# EAGLE design PLT Demo V2 R01 (EAGLE 9.6.2)
PCBITEM: T10-00438-XX; REVISION: R01

## Sheet 1 of 4: Power schematic
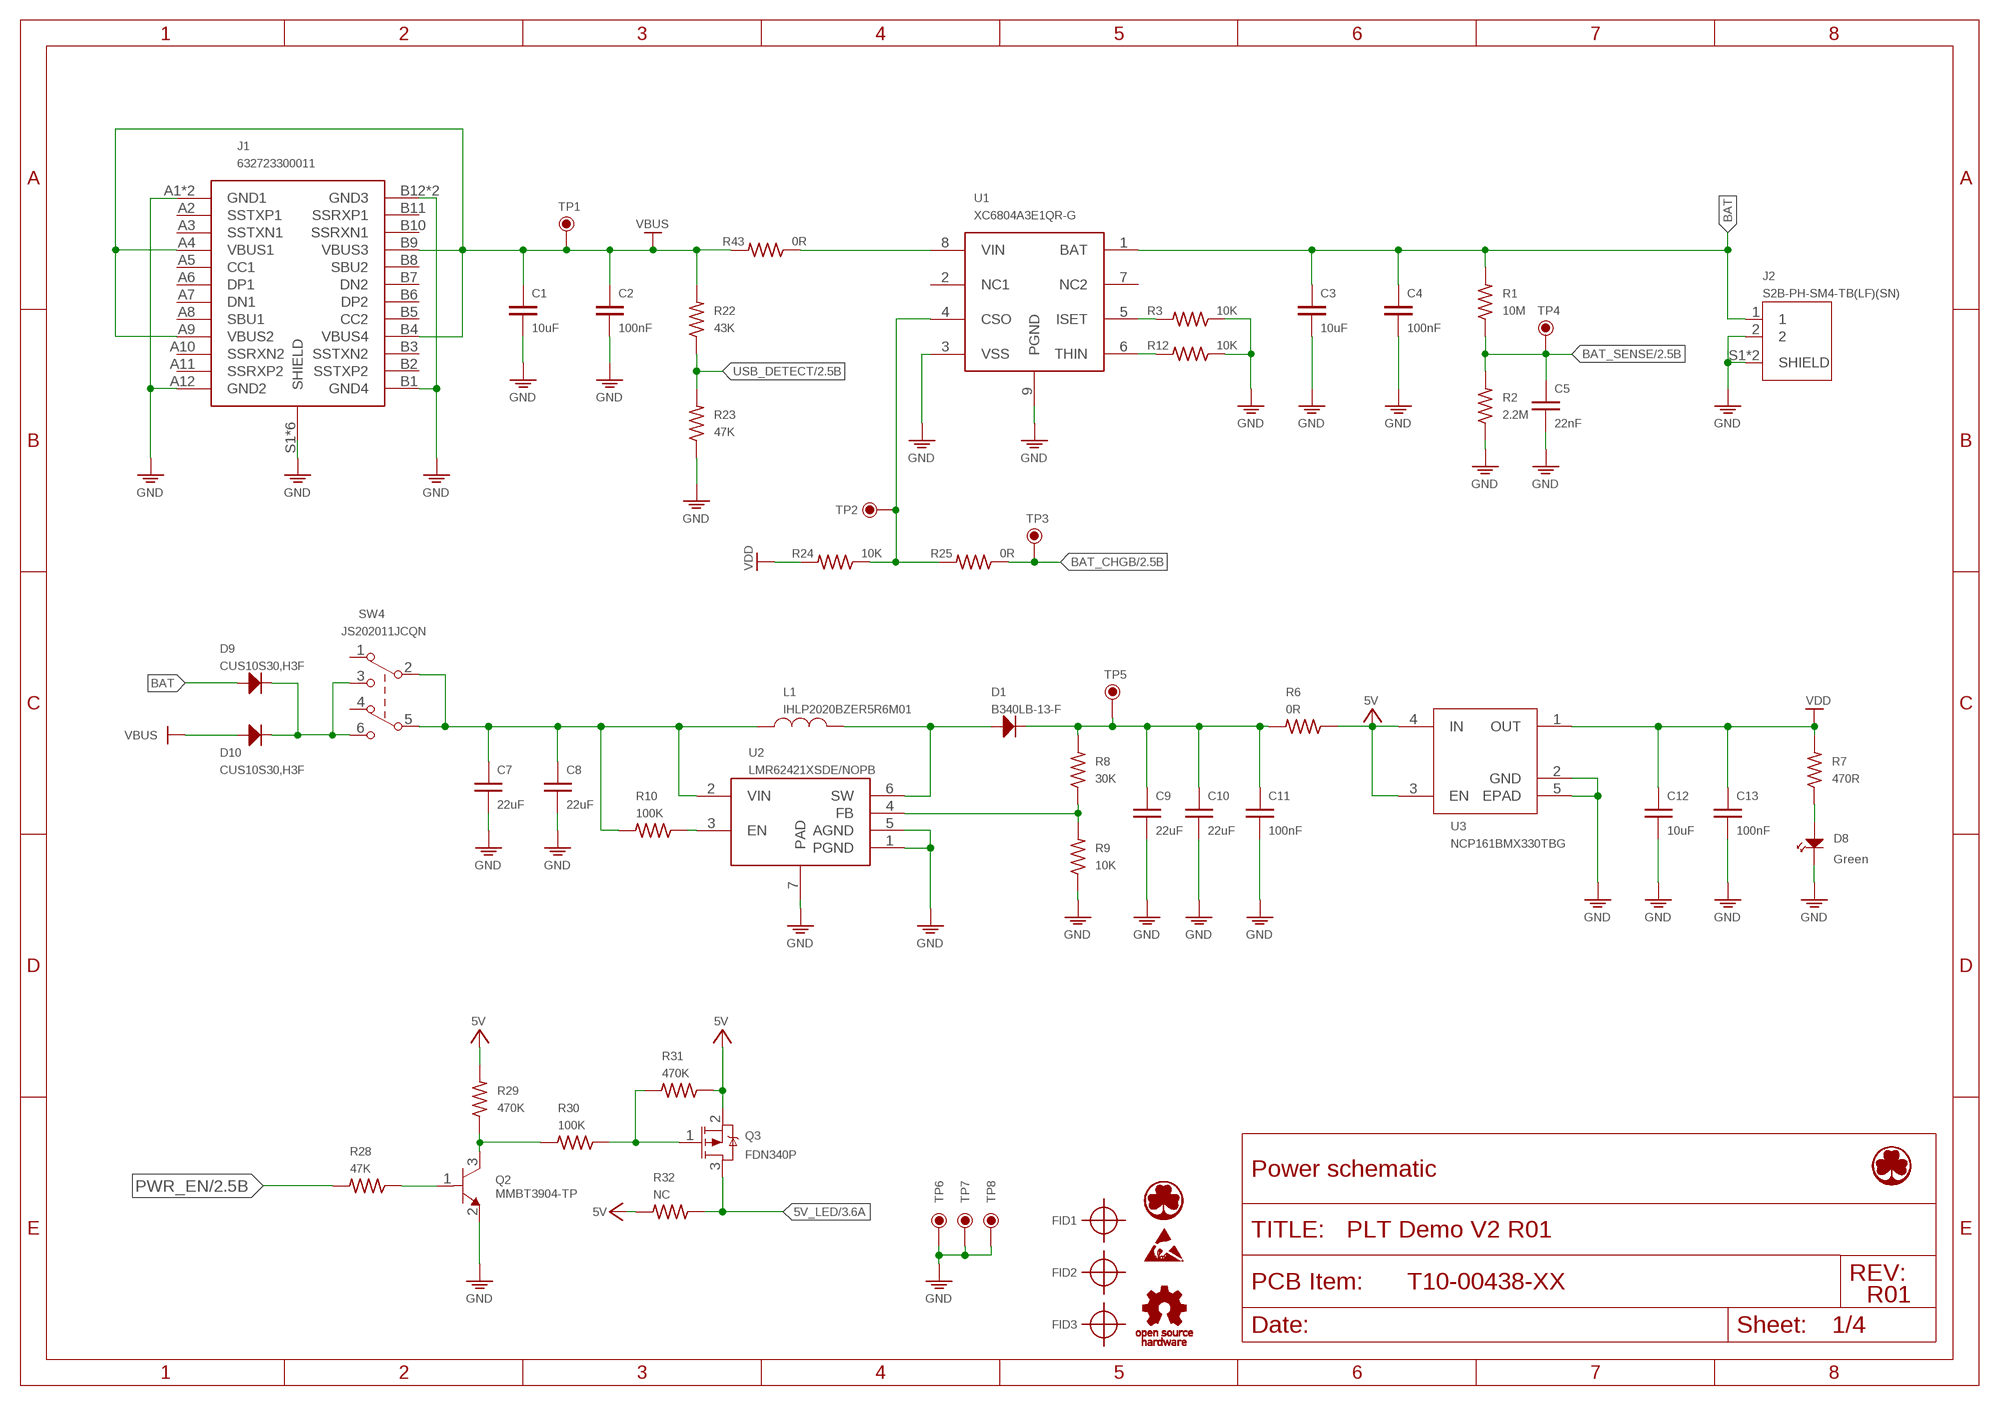
[diagram p0: schematic, sheet 1]

### Parts
C1  10uF  CAPC0603  [C0603]
C2  100nF  CAPC0603  [C0603]
C3  10uF  CAPC0603  [C0603]
C4  100nF  CAPC0603  [C0603]
C5  22nF  CAPC0603  [C0603]
C7  22uF  CAPC0603  [C0603]
C8  22uF  CAPC0603  [C0603]
C9  22uF  CAPC0603  [C0603]
C10  22uF  CAPC0603  [C0603]
C11  100nF  CAPC0603  [C0603]
C12  10uF  CAPC0603  [C0603]
C13  100nF  CAPC0603  [C0603]
D1  B340LB-13-F  [SMB]
D8  Green  LED-SMTLED0603  [LED0603]
D9  CUS10S30,H3F  [SOD-323]
D10  CUS10S30,H3F  [SOD-323]
FID1  SENSOR_MISC_FIDUCIAL-1MM  [SENSOR_MISC_FIDUCIAL-1MM]
FID2  SENSOR_MISC_FIDUCIAL-1MM  [SENSOR_MISC_FIDUCIAL-1MM]
FID3  SENSOR_MISC_FIDUCIAL-1MM  [SENSOR_MISC_FIDUCIAL-1MM]
J1  632723300011  632723X00011  [632723X00011]
J2  S2B-PH-SM4-TB(LF)(SN)  [S2B-PH-SM4-TB(LF)(SN)]
L1  IHLP2020BZER5R6M01  [IND-5220_SMD]
Q2  MMBT3904-TP  [SOT23]
Q3  FDN340P  [SOT23]
R1  10M  RESISTOR_USR0603  [R0603]
R2  2.2M  RESISTOR_USR0603  [R0603]
R3  10K  RESISTOR_USR0603  [R0603]
R6  0R  RESISTOR_USR0603  [R0603]
R7  470R  RESISTOR_USR0603  [R0603]
R8  30K  RESISTOR_USR0603  [R0603]
R9  10K  RESISTOR_USR0603  [R0603]
R10  100K  RESISTOR_USR0603  [R0603]
R12  10K  RESISTOR_USR0603  [R0603]
R22  43K  RESISTOR_USR0603  [R0603]
R23  47K  RESISTOR_USR0603  [R0603]
R24  10K  RESISTOR_USR0603  [R0603]
R25  0R  RESISTOR_USR0603  [R0603]
R28  47K  RESISTOR_USR0603  [R0603]
R29  470K  RESISTOR_USR0603  [R0603]
R30  100K  RESISTOR_USR0603  [R0603]
R31  470K  RESISTOR_USR0603  [R0603]
R32  NC  RESISTOR_USR0603  [R0603]
R43  0R  RESISTOR_USR0603  [R0603]
SW4  JS202011JCQN  [JS202011JCQN]
TP1  TPTP1.0X0.5_DIP  [TP1.0X0.5_DIP]
TP2  TPTP1.0X0.5_DIP  [TP1.0X0.5_DIP]
TP3  TPTP1.0X0.5_DIP  [TP1.0X0.5_DIP]
TP4  TPTP1.0X0.5_DIP  [TP1.0X0.5_DIP]
TP5  TPTP1.0X0.5_DIP  [TP1.0X0.5_DIP]
TP6  TPTP1.0X0.5_DIP  [TP1.0X0.5_DIP]
TP7  TPTP1.0X0.5_DIP  [TP1.0X0.5_DIP]
TP8  TPTP1.0X0.5_DIP  [TP1.0X0.5_DIP]
U1  XC6804A3E1QR-G  [SOP127P6X1.6-8NP]
U2  LMR62421XSDE/NOPB  [WSON095P3X3-6NPAD]
U3  NCP161BMX330TBG  [XDFN4]
U$4  BCD-LOGO  [BCD-LOGO]
U$5  ANTI-STATIC  [ANTI-STATIC]
U$6  OSHW-LOGO-R2000  [OSHW-LOGO-R2000]

### Nets
5V: Q3.2(S) R6.1 R29.2 R31.1 R32.2 U3.3(EN) U3.4(IN)
5V_LED: Q3.3(D) R32.1 ; also sheet 3
BAT: C3.1 C4.1 D9.1 J2.1 R1.2 U1.1(BAT)
BAT_CHGB: R25.1 TP3.1 ; also sheet 2
BAT_CHGB2: R24.1 R25.2 TP2.1 U1.4(CSO)
BAT_SENSE: C5.1 R1.1 R2.2 TP4.1 ; also sheet 2
GND: C1.2 C2.2 C3.2 C4.2 C5.2 C7.2 C8.2 C9.2 C10.2 C11.2 C12.2 C13.2 D8.2 J1.A1(GND1) J1.A12(GND2) J1.B1(GND4) J1.B12(GND3) J1.GND1(GND3) J1.GND(GND1) J1.S1(SHIELD) J1.S2(SHIELD) J1.S3(SHIELD) J1.S4(SHIELD) J1.S5(SHIELD) J1.S6(SHIELD) J2.2 J2.S1(SHIELD) J2.S2(SHIELD) Q2.2(E) R2.1 R3.1 R9.1 R12.1 R23.1 TP6.1 TP7.1 TP8.1 U1.3(VSS) U1.9(PGND) U2.1(PGND) U2.5(AGND) U2.7(PAD) U3.2(GND) U3.5(EPAD) ; also sheet 2,3,4
N$2: D1.1 L1.2 U2.6(SW)
N$3: C7.1 C8.1 L1.1 R10.2 SW4.2 SW4.5 U2.2(VIN)
N$4: R10.1 U2.3(EN)
N$5: R3.2 U1.5(ISET)
N$6: R43.1 U1.8(VIN)
N$7: R8.1 R9.2 U2.4(FB)
N$8: C9.1 C10.1 C11.1 D1.2 R6.2 R8.2 TP5.1
N$11: D8.1 R7.1
N$12: R12.2 U1.6(THIN)
N$13: Q2.3(C) R29.1 R30.2
N$14: Q2.1(B) R28.1
N$15: Q3.1(G) R30.1 R31.2
N$63: D9.2 D10.2 SW4.3 SW4.6
PWR_EN: R28.2 ; also sheet 2
USB_DETECT: R22.1 R23.2 ; also sheet 2
VBUS: C1.1 C2.1 D10.1 J1.A4(VBUS1) J1.A9(VBUS2) J1.B4(VBUS4) J1.B9(VBUS3) R22.2 R43.2 TP1.1
VDD: C12.1 C13.1 R7.2 R24.2 U3.1(OUT) ; also sheet 2,3,4
Unconnected: J1.A2(SSTXP1) J1.A3(SSTXN1) J1.A5(CC1) J1.A6(DP1) J1.A7(DN1) J1.A8(SBU1) J1.A10(SSRXN2) J1.A11(SSRXP2) J1.B2(SSTXP2) J1.B3(SSTXN2) J1.B5(CC2) J1.B6(DP2) J1.B7(DN2) J1.B8(SBU2) J1.B10(SSRXN1) J1.B11(SSRXP1) SW4.1 SW4.4 U1.2(NC1) U1.7(NC2)

## Sheet 2 of 4: Bluetooth schematic
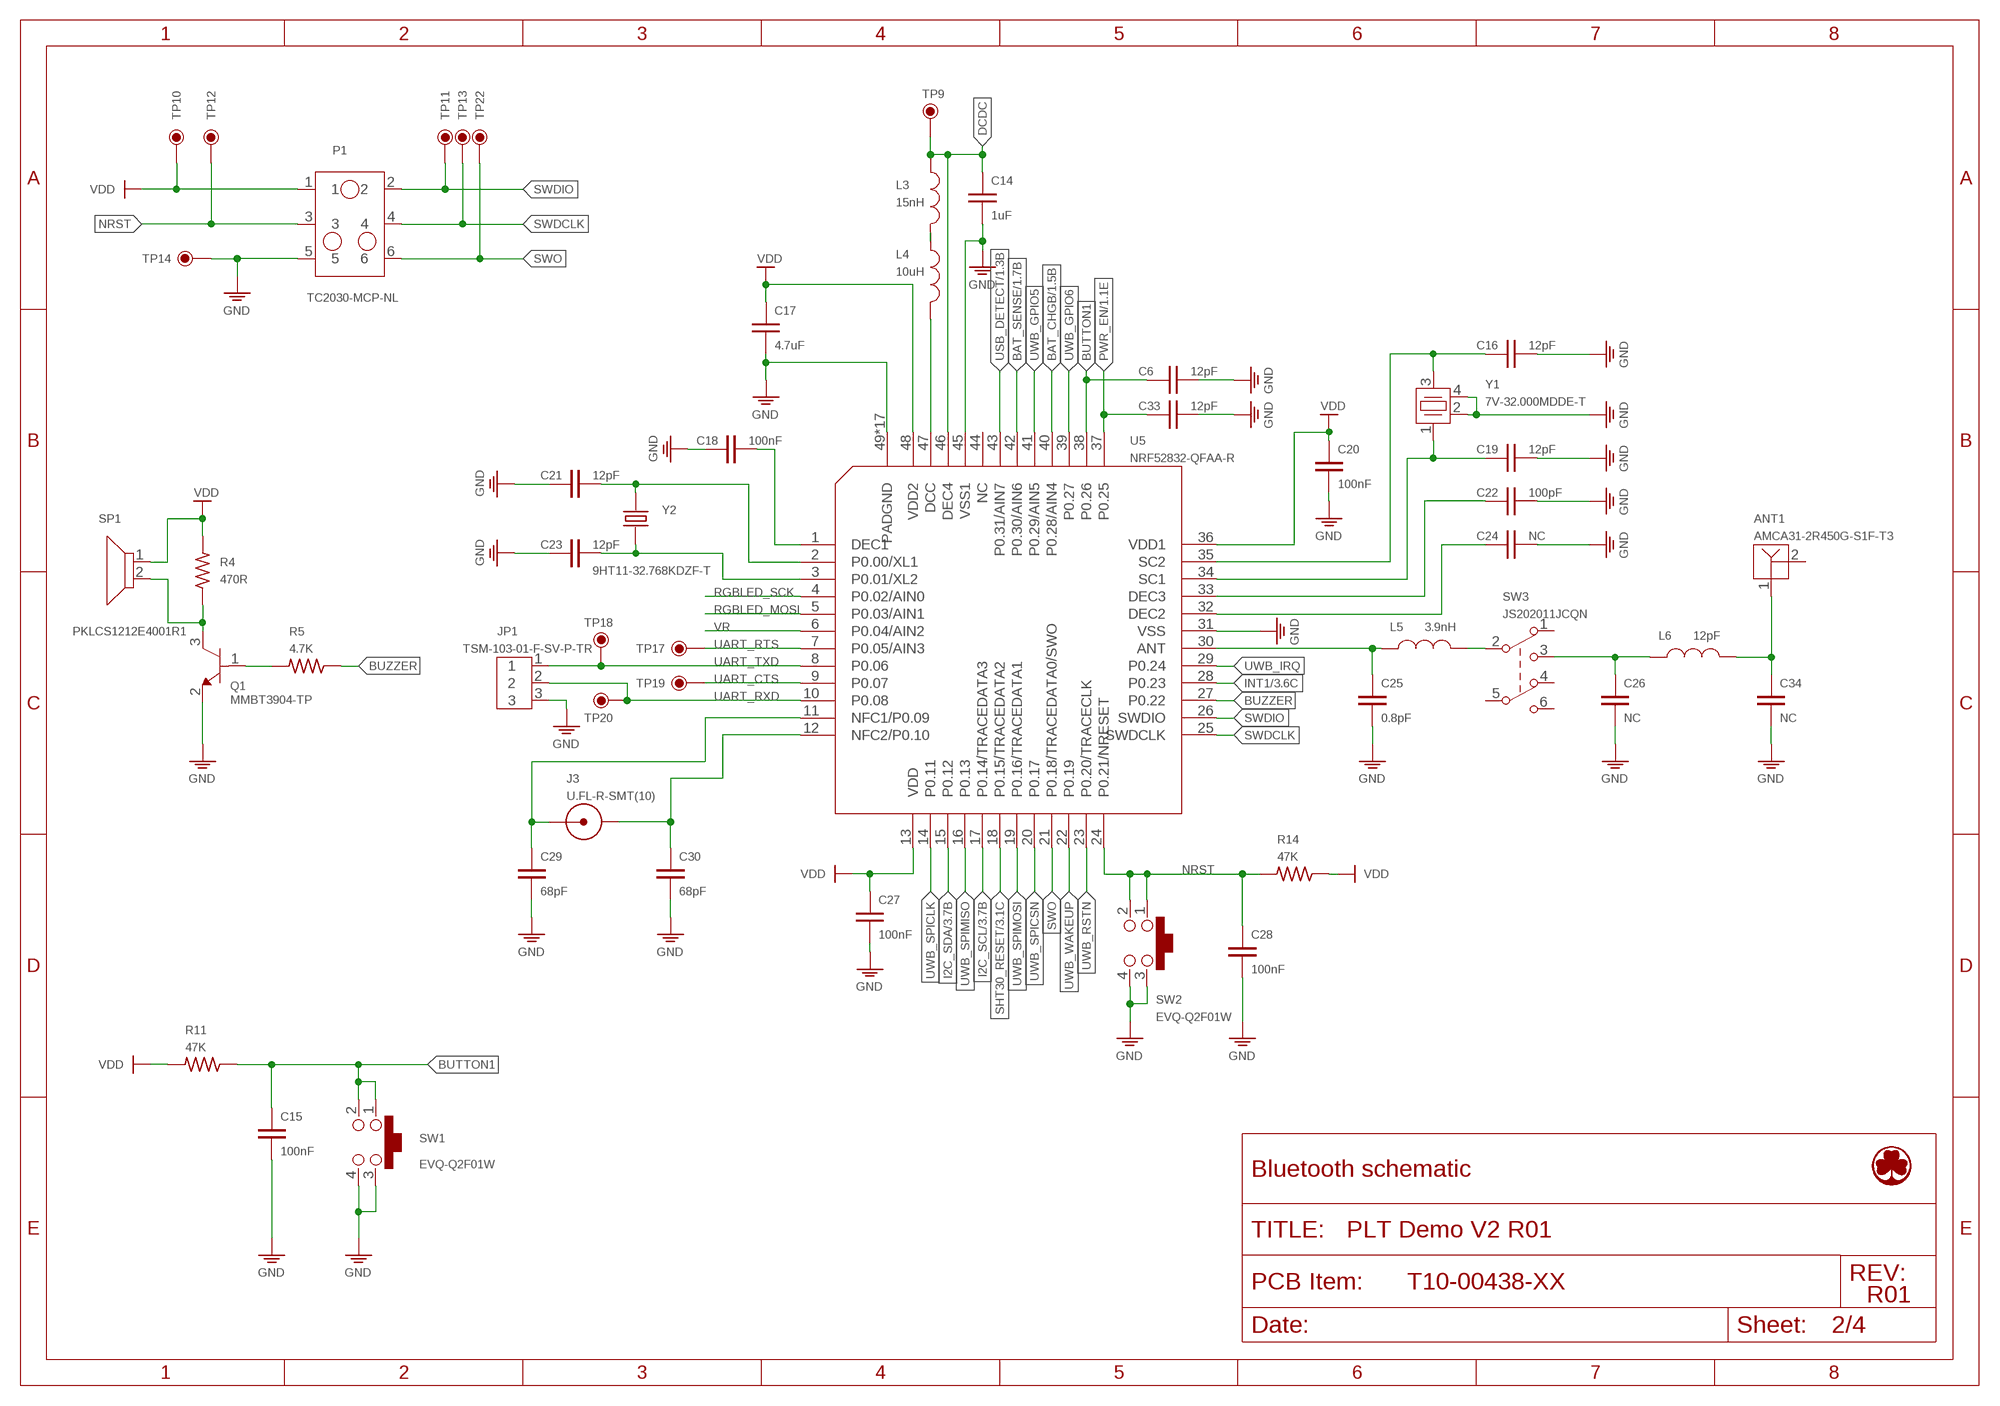
[diagram p1: schematic, sheet 2]

### Parts
ANT1  AMCA31-2R450G-S1F-T3  [ANT_3216]
C6  12pF  CAPC0603  [C0603]
C14  1uF  CAPC0603  [C0603]
C15  100nF  CAPC0603  [C0603]
C16  12pF  CAPC0603  [C0603]
C17  4.7uF  CAPC0603  [C0603]
C18  100nF  CAPC0603  [C0603]
C19  12pF  CAPC0603  [C0603]
C20  100nF  CAPC0603  [C0603]
C21  12pF  CAPC0603  [C0603]
C22  100pF  CAPC0603  [C0603]
C23  12pF  CAPC0603  [C0603]
C24  NC  CAPC0603  [C0603]
C25  0.8pF  CAPC0603  [C0603]
C26  NC  CAPC0603  [C0603]
C27  100nF  CAPC0603  [C0603]
C28  100nF  CAPC0603  [C0603]
C29  68pF  CAPC0603  [C0603]
C30  68pF  CAPC0603  [C0603]
C33  12pF  CAPC0603  [C0603]
C34  NC  CAPC0603  [C0603]
J3  U.FL-R-SMT(10)  [U.FL-R-SMT(10)]
JP1  TSM-103-01-F-SV-P-TR  [JMP254P1X3V-SMT]
L3  15nH  INDUCTOR-2N0603  [IND-0603]
L4  10uH  INDUCTOR-2N0603  [IND-0603]
L5  3.9nH  INDUCTOR-2N0603  [IND-0603]
L6  12pF  INDUCTOR-2N0603  [IND-0603]
P1  TC2030-MCP-NL  [TC2030-IDC]
Q1  MMBT3904-TP  [SOT23]
R4  470R  RESISTOR_USR0603  [R0603]
R5  4.7K  RESISTOR_USR0603  [R0603]
R11  47K  RESISTOR_USR0603  [R0603]
R14  47K  RESISTOR_USR0603  [R0603]
SP1  PKLCS1212E4001R1  [SPEAKER12X12_SMT]
SW1  EVQ-Q2F01W  SWITCH-4N-SMT  [SWITCH6.5X6_SMD]
SW2  EVQ-Q2F01W  SWITCH-4N-SMT  [SWITCH6.5X6_SMD]
SW3  JS202011JCQN  [JS202011JCQN]
TP9  TPTP1.0X0.5_DIP  [TP1.0X0.5_DIP]
TP10  TPTP1.0X0.5_DIP  [TP1.0X0.5_DIP]
TP11  TPTP1.0X0.5_DIP  [TP1.0X0.5_DIP]
TP12  TPTP1.0X0.5_DIP  [TP1.0X0.5_DIP]
TP13  TPTP1.0X0.5_DIP  [TP1.0X0.5_DIP]
TP14  TPTP1.0X0.5_DIP  [TP1.0X0.5_DIP]
TP17  TPTP1.0X0.5_DIP  [TP1.0X0.5_DIP]
TP18  TPTP1.0X0.5_DIP  [TP1.0X0.5_DIP]
TP19  TPTP1.0X0.5_DIP  [TP1.0X0.5_DIP]
TP20  TPTP1.0X0.5_DIP  [TP1.0X0.5_DIP]
TP22  TPTP1.0X0.5_DIP  [TP1.0X0.5_DIP]
U5  NRF52832-QFAA-R  NRF52832-QFAA-R-48NV  [QFN040P6X6-48NV]
Y1  7V-32.000MDDE-T  [OSC3.2X2.5-4N]
Y2  9HT11-32.768KDZF-T  [OSC2X1.2-2N]

### Nets
BAT_CHGB: U5.40(P0.28/AIN4) ; also sheet 1
BAT_SENSE: U5.42(P0.30/AIN6) ; also sheet 1
BUTTON1: C6.1 C15.1 R11.1 SW1.1 SW1.2 U5.38(P0.26)
BUZZER: R5.1 U5.27(P0.22)
DCDC: C14.1 L3.1 TP9.1 U5.46(DEC4)
GND: C6.2 C14.2 C15.2 C16.2 C17.2 C18.1 C19.2 C20.2 C21.1 C22.2 C23.1 C24.2 C25.2 C26.2 C27.2 C28.2 C29.2 C30.2 C33.2 C34.2 JP1.3 P1.5 Q1.2(E) SW1.3 SW1.4 SW2.3 SW2.4 TP14.1 U5.31(VSS) U5.45(VSS1) U5.49(PADGND) U5.P$1(PADGND) U5.P$2(PADGND) U5.P$3(PADGND) U5.P$4(PADGND) U5.P$5(PADGND) U5.P$6(PADGND) U5.P$7(PADGND) U5.P$8(PADGND) U5.P$9(PADGND) U5.P$10(PADGND) U5.P$11(PADGND) U5.P$12(PADGND) U5.P$13(PADGND) U5.P$14(PADGND) U5.P$15(PADGND) U5.P$16(PADGND) Y1.2 Y1.4 ; also sheet 1,3,4
I2C_SCL: U5.17(P0.14/TRACEDATA3) ; also sheet 3
I2C_SDA: U5.15(P0.12) ; also sheet 3
INT1: U5.28(P0.23) ; also sheet 3
N$9: C18.2 U5.1(DEC1)
N$10: C21.2 U5.2(P0.00/XL1) Y2.1
N$16: C23.2 U5.3(P0.01/XL2) Y2.2
N$17: C30.1 J3.2 J3.3 U5.12(NFC2/P0.10)
N$18: C29.1 J3.1 U5.11(NFC1/P0.09)
N$20: C25.1 L5.1 U5.30(ANT)
N$21: L3.2 L4.1
N$22: L4.2 U5.47(DCC)
N$33: C16.1 U5.35(SC2) Y1.3
N$34: Q1.3(C) R4.1 SP1.2
N$35: Q1.1(B) R5.2
N$36: C19.1 U5.34(SC1) Y1.1
N$37: C22.1 U5.33(DEC3)
N$38: C24.1 U5.32(DEC2)
N$39: L5.2 SW3.2
N$40: C26.1 L6.1 SW3.3
N$41: ANT1.1 C34.1 L6.2
NRST: C28.1 P1.3 R14.2 SW2.1 SW2.2 TP12.1 U5.24(P0.21/NRESET)
PWR_EN: C33.1 U5.37(P0.25) ; also sheet 1
RGBLED_MOSI: U5.5(P0.03/AIN1) ; also sheet 3
RGBLED_SCK: U5.4(P0.02/AIN0) ; also sheet 3
SHT30_RESET: U5.18(P0.15/TRACEDATA2) ; also sheet 3
SWDCLK: P1.4 TP13.1 U5.25(SWDCLK)
SWDIO: P1.2 TP11.1 U5.26(SWDIO)
SWO: P1.6 TP22.1 U5.21(P0.18/TRACEDATA0/SWO)
UART_CTS: TP19.1 U5.9(P0.07)
UART_RTS: TP17.1 U5.7(P0.05/AIN3)
UART_RXD: JP1.2 TP20.1 U5.10(P0.08)
UART_TXD: JP1.1 TP18.1 U5.8(P0.06)
USB_DETECT: U5.43(P0.31/AIN7) ; also sheet 1
UWB_GPIO5: U5.41(P0.29/AIN5)
UWB_GPIO6: U5.39(P0.27)
UWB_IRQ: U5.29(P0.24)
UWB_RSTN: U5.23(P0.20/TRACECLK)
UWB_SPICLK: U5.14(P0.11)
UWB_SPICSN: U5.20(P0.17)
UWB_SPIMISO: U5.16(P0.13)
UWB_SPIMOSI: U5.19(P0.16/TRACEDATA1)
UWB_WAKEUP: U5.22(P0.19)
VDD: C17.1 C20.1 C27.1 P1.1 R4.2 R11.2 R14.1 SP1.1 TP10.1 U5.13(VDD) U5.36(VDD1) U5.48(VDD2) ; also sheet 1,3,4
VR: U5.6(P0.04/AIN2) ; also sheet 3
Unconnected: ANT1.2 SW3.1 SW3.4 SW3.5 SW3.6 U5.44(NC)

## Sheet 3 of 4: LED schematic
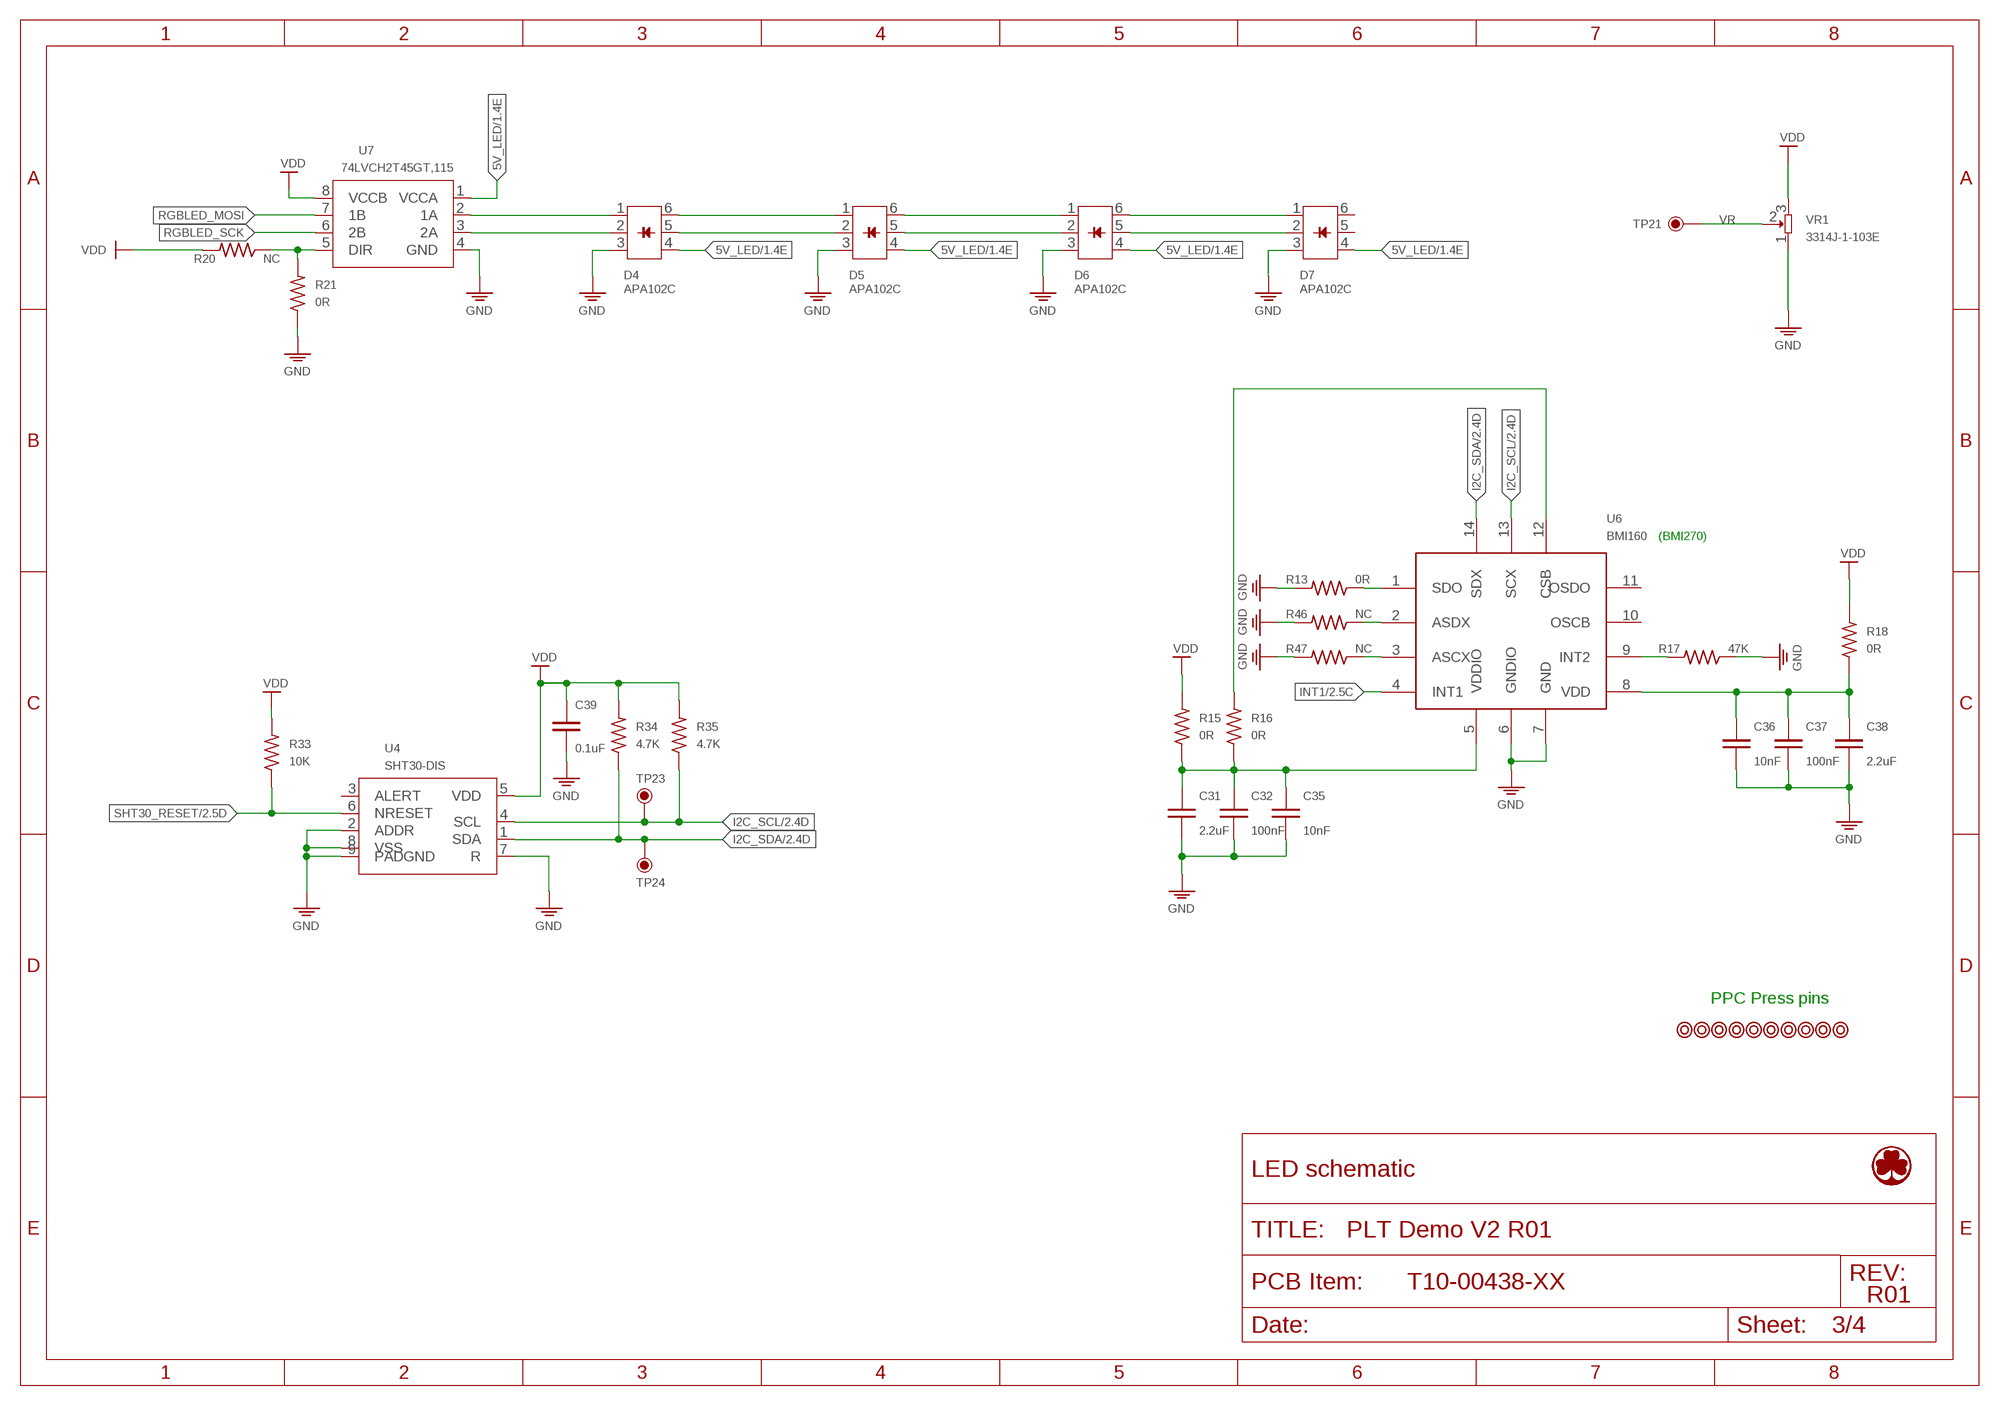
[diagram p2: schematic, sheet 3]

### Parts
C31  2.2uF  CAPC0603  [C0603]
C32  100nF  CAPC0603  [C0603]
C35  10nF  CAPC0603  [C0603]
C36  10nF  CAPC0603  [C0603]
C37  100nF  CAPC0603  [C0603]
C38  2.2uF  CAPC0603  [C0603]
C39  0.1uF  CAPC0603  [C0603]
D4  APA102C  [LED5X5-6N]
D5  APA102C  [LED5X5-6N]
D6  APA102C  [LED5X5-6N]
D7  APA102C  [LED5X5-6N]
PIN1  PRESS-PINS  [PRESS-PINS]
PIN2  PRESS-PINS  [PRESS-PINS]
PIN3  PRESS-PINS  [PRESS-PINS]
PIN4  PRESS-PINS  [PRESS-PINS]
PIN5  PRESS-PINS  [PRESS-PINS]
PIN6  PRESS-PINS  [PRESS-PINS]
PIN7  PRESS-PINS  [PRESS-PINS]
PIN8  PRESS-PINS  [PRESS-PINS]
PIN9  PRESS-PINS  [PRESS-PINS]
PIN10  PRESS-PINS  [PRESS-PINS]
R13  0R  RESISTOR_USR0603  [R0603]
R15  0R  RESISTOR_USR0603  [R0603]
R16  0R  RESISTOR_USR0603  [R0603]
R17  47K  RESISTOR_USR0603  [R0603]
R18  0R  RESISTOR_USR0603  [R0603]
R20  NC  RESISTOR_USR0603  [R0603]
R21  0R  RESISTOR_USR0603  [R0603]
R33  10K  RESISTOR_USR0603  [R0603]
R34  4.7K  RESISTOR_USR0603  [R0603]
R35  4.7K  RESISTOR_USR0603  [R0603]
R46  NC  RESISTOR_USR0603  [R0603]
R47  NC  RESISTOR_USR0603  [R0603]
TP21  TPTP1.0X0.5_DIP  [TP1.0X0.5_DIP]
TP23  TPTP1.0X0.5_DIP  [TP1.0X0.5_DIP]
TP24  TPTP1.0X0.5_DIP  [TP1.0X0.5_DIP]
U4  SHT30-DIS  SHT30-DISDFN050P2.5X2.5-8N  [DFN050P2.5X2.5-8N]
U6  BMI160  [LGA050P3X2.5-14N]
U7  74LVCH2T45GT,115  [XSON8-SOT833-1]
VR1  3314J-1-103E  [3314J-1-103E]

### Nets
5V_LED: D4.4 D5.4 D6.4 D7.4 U7.1(VCCA) ; also sheet 1
GND: C31.2 C32.2 C35.2 C36.2 C37.2 C38.2 C39.1 D4.3 D5.3 D6.3 D7.3 R13.2 R17.1 R21.1 R46.2 R47.2 U4.2(ADDR) U4.7(R) U4.8(VSS) U4.9(PADGND) U6.6(GNDIO) U6.7(GND) U7.4(GND) VR1.1 ; also sheet 1,2,4
I2C_SCL: R35.1 TP23.1 U4.4(SCL) U6.13(SCX) ; also sheet 2
I2C_SDA: R34.1 TP24.1 U4.1(SDA) U6.14(SDX) ; also sheet 2
INT1: U6.4(INT1) ; also sheet 2
N$1: R47.1 U6.3(ASCX)
N$19: R13.1 U6.1(SDO)
N$23: D4.1 U7.2(1A)
N$24: D4.2 U7.3(2A)
N$25: D4.6 D5.1
N$26: D4.5 D5.2
N$27: D5.6 D6.1
N$28: D5.5 D6.2
N$29: D6.6 D7.1
N$30: D6.5 D7.2
N$31: R17.2 U6.9(INT2)
N$32: R20.1 R21.2 U7.5(DIR)
N$42: C31.1 C32.1 C35.1 R15.1 R16.1 U6.5(VDDIO)
N$43: R16.2 U6.12(CSB)
N$44: C36.1 C37.1 C38.1 R18.1 U6.8(VDD)
N$62: R46.1 U6.2(ASDX)
RGBLED_MOSI: U7.7(1B) ; also sheet 2
RGBLED_SCK: U7.6(2B) ; also sheet 2
SHT30_RESET: R33.1 U4.6(NRESET) ; also sheet 2
VDD: C39.2 R15.2 R18.2 R20.2 R33.2 R34.2 R35.2 U4.5(VDD) U7.8(VCCB) VR1.3 ; also sheet 1,2,4
VR: TP21.1 VR1.2 ; also sheet 2
Unconnected: D7.5 D7.6 U4.3(ALERT) U6.10(OSCB) U6.11(OSDO)

### Notes on the sheet
- (BMI270)
- PPC Press pins

## Sheet 4 of 4: Test
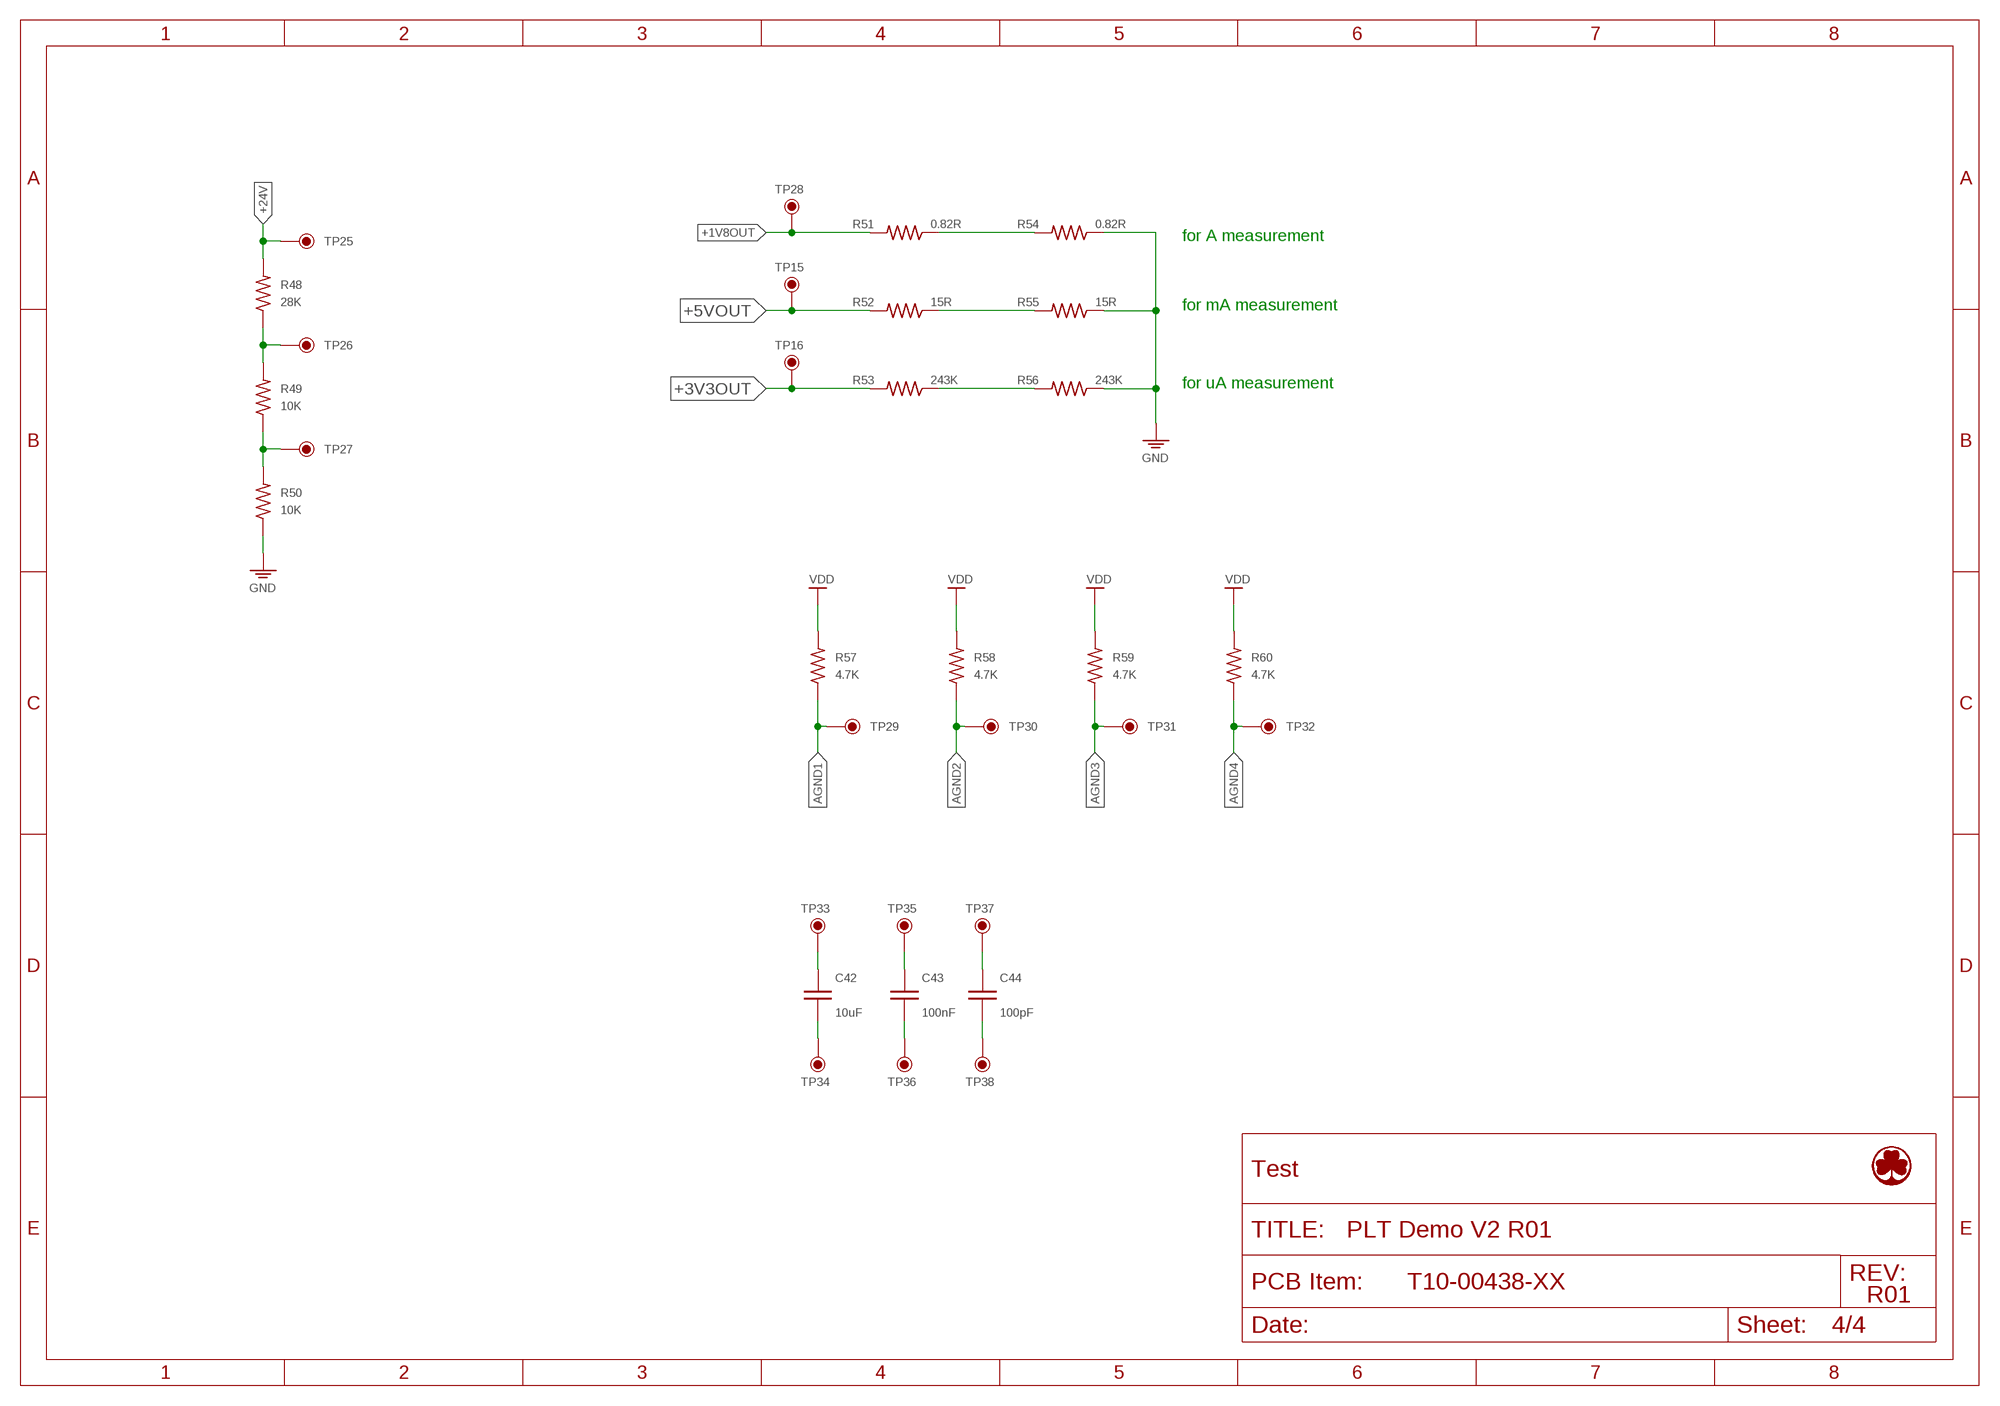
[diagram p3: schematic, sheet 4]

### Parts
C42  10uF  CAPC0805  [C0805]
C43  100nF  CAPC0603  [C0603]
C44  100pF  CAPC0603  [C0603]
R48  28K  RESISTOR_USR0603  [R0603]
R49  10K  RESISTOR_USR0603  [R0603]
R50  10K  RESISTOR_USR0603  [R0603]
R51  0.82R  RESISTOR_USR1210  [R1210]
R52  15R  RESISTOR_USR0805  [R0805]
R53  243K  RESISTOR_USR0603  [R0603]
R54  0.82R  RESISTOR_USR1210  [R1210]
R55  15R  RESISTOR_USR0805  [R0805]
R56  243K  RESISTOR_USR0603  [R0603]
R57  4.7K  RESISTOR_USR0603  [R0603]
R58  4.7K  RESISTOR_USR0603  [R0603]
R59  4.7K  RESISTOR_USR0603  [R0603]
R60  4.7K  RESISTOR_USR0603  [R0603]
TP15  TPTP1.0X0.5_DIP  [TP1.0X0.5_DIP]
TP16  TPTP1.0X0.5_DIP  [TP1.0X0.5_DIP]
TP25  TPTP1.0X0.5_DIP  [TP1.0X0.5_DIP]
TP26  TPTP1.0X0.5_DIP  [TP1.0X0.5_DIP]
TP27  TPTP1.0X0.5_DIP  [TP1.0X0.5_DIP]
TP28  TPTP1.0X0.5_DIP  [TP1.0X0.5_DIP]
TP29  TPTP1.0X0.5_DIP  [TP1.0X0.5_DIP]
TP30  TPTP1.0X0.5_DIP  [TP1.0X0.5_DIP]
TP31  TPTP1.0X0.5_DIP  [TP1.0X0.5_DIP]
TP32  TPTP1.0X0.5_DIP  [TP1.0X0.5_DIP]
TP33  TPTP1.0X0.5_DIP  [TP1.0X0.5_DIP]
TP34  TPTP1.0X0.5_DIP  [TP1.0X0.5_DIP]
TP35  TPTP1.0X0.5_DIP  [TP1.0X0.5_DIP]
TP36  TPTP1.0X0.5_DIP  [TP1.0X0.5_DIP]
TP37  TPTP1.0X0.5_DIP  [TP1.0X0.5_DIP]
TP38  TPTP1.0X0.5_DIP  [TP1.0X0.5_DIP]

### Nets
+1V8OUT: R51.2 TP28.1
+3V3OUT: R53.2 TP16.1
+5VOUT: R52.2 TP15.1
+24V: R48.2 TP25.1
AGND1: R57.1 TP29.1
AGND2: R58.1 TP30.1
AGND3: R59.1 TP31.1
AGND4: R60.1 TP32.1
GND: R50.1 R54.1 R55.1 R56.1 ; also sheet 1,2,3
N$45: R51.1 R54.2
N$46: R52.1 R55.2
N$47: R53.1 R56.2
N$64: R49.1 R50.2 TP27.1
N$65: R48.1 R49.2 TP26.1
N$72: C42.2 TP34.1
N$73: C42.1 TP33.1
N$74: C43.2 TP36.1
N$75: C43.1 TP35.1
N$76: C44.2 TP38.1
N$77: C44.1 TP37.1
VDD: R57.2 R58.2 R59.2 R60.2 ; also sheet 1,2,3

### Notes on the sheet
- for A measurement
- for mA measurement
- for uA measurement

## Library data of the parts
ANT1 = Eagle Part Library:AMCA31-2R450G-S1F-T3: RF ANT 2.4GHZ CHIP SOLDER SMD Source: Datasheet <https://abracon.com/chip-antenna/AMCA31-2R450G-S1F-T3.pdf>; MANUFACTURER_PART_NUMBER: AMCA31-2R450G-S1F-T3; VENDOR: Abracon LLC
C1-C39 C42-C44 = Eagle Part Library:CAP
D1 = Eagle Part Library:B340LB-13-F: DIODE SCHOTTKY 40V 3A SMB Source: Datasheet <https://www.diodes.com/assets/Datasheets/ds30240.pdf>; MANUFACTURER_PART_NUMBER: B340LB-13-F; VENDOR: Diodes Incorporated
D4-D7 = Eagle Part Library:APA102C
D8 = Eagle Part Library:LED-SMT
D9 D10 = Eagle Part Library:CUS10S30,H3F: DIODE SCHOTTKY 30V 1A USC Source: Datasheet <https://toshiba.semicon-storage.com/info/docget.jsp?did=14077&prodName=CUS10S30>; MANUFACTURER_PART_NUMBER: CUS10S30,H3F; VENDOR: Toshiba Semiconductor and Storage
FID1-FID3 = Eagle Part Library:SENSOR_MISC_FIDUCIAL: Fiducial marker on PCB. This has a matching schematic symbol so that it can show up in a centroid file.
J1 = Eagle Part Library:632723X00011: USB-C (USB TYPE-C) USB 3.2 Gen 2 (USB 3.1 Gen 2, Superspeed + (USB 3.1)) Receptacle Connector 24 Position Surface Mount, Right Angle; Through Hole Source: Datasheet <https://katalog.we-online.de/em/datasheet/632723x00011.pdf>; MANUFACTURER_PART_NUMBER: 632723300011; VENDOR: Wurth Electronics
J2 = Eagle Part Library:S2B-PH-SM4-TB(LF)(SN): CONN HEADER SMD R/A 2POS 2MM Source: Datasheet <https://www.jst-mfg.com/product/pdf/eng/ePH.pdf>; MANUFACTURER_PART_NUMBER: S2B-PH-SM4-TB(LF)(SN); VENDOR: JST Sales America Inc
J3 = Eagle Part Library:U.FL-R-SMT(10): CONN U.FL RCPT STR 50 OHM SMD Source: Datasheet <https://media.digikey.com/pdf/Data%20Sheets/Hirose%20PDFs/UFL%20Series.pdf>; MANUFACTURER_PART_NUMBER: U.FL-R-SMT(10); VENDOR: Hirose Electric Co Ltd
JP1 = Eagle Part Library:TSM-103-01-F-SV-P-TR: CONN HEADER SMD 3POS 2.54MM Source: Datasheet <https://www.digikey.hk/en/product-highlight/s/samtec/flexible-stacking-solutions>; MANUFACTURER_PART_NUMBER: TSM-103-01-F-SV-P-TR; VENDOR: Samtec Inc
L1 = Eagle Part Library:IHLP2020BZER5R6M01: FIXED IND 5.6UH 2.5A 122 MOHM Source: Datasheet <https://www.vishay.com/docs/34253/ihlp-2020bz-01.pdf>; MANUFACTURER_PART_NUMBER: IHLP2020BZER5R6M01; VENDOR: Vishay Dale
L3-L6 = Eagle Part Library:INDUCTOR-2N
P1 = Eagle Part Library:TC2030-MCP-NL: CABLE TAG-CONNECT IN-CIRCUIT Source: Datasheet <https://www.tag-connect.com/wp-content/uploads/bsk-pdf-manager/TC2030-MCP-NL_PCB_Footprint_5.pdf>; MANUFACTURER_PART_NUMBER: TC2030-MCP-NL-10-ND; VENDOR: Tag-Connect LLC
PIN1-PIN10 = Eagle Part Library:PRESS-PINS: press pins
Q1 Q2 = Eagle Part Library:MMBT3904-TP: TRANSISTOR NPN 40V 200MA SOT-23
Q3 = Eagle Part Library:FDN340P: MOSFET P-CH 20V 2A SOT3 Source: Datasheet <https://www.onsemi.com/pub/Collateral/FDN340P-D.PDF>; MANUFACTURER_PART_NUMBER: FDN340P; VENDOR: ON Semiconductor
R1-R18 R20-R25 R28-R35 R43 R46-R60 = Eagle Part Library:RESISTOR_US: RESISTOR, American symbol
SP1 = Eagle Part Library:PKLCS1212E4001R1: BUZZER SMD CONTINUOUS 75DB 4KHZ
SW1 SW2 = Eagle Part Library:SWITCH-4N-SMT
SW3 SW4 = Eagle Part Library:JS202011JCQN: SWITCH SLIDE DPDT 300MA 6V Source: Datasheet <https://www.ckswitches.com/media/1422/js.pdf>; MANUFACTURER_PART_NUMBER: JS202011JCQN; VENDOR: C&K
TP1-TP38 = Eagle Part Library:TP: Teset
U1 = Eagle Part Library:XC6804A3E1QR-G: IC BATT CHG LI-ION 1CELL 8SOPFD Source: Datasheet <https://www.torexsemi.com/file/xc6804/XC6804.pdf>; MANUFACTURER_PART_NUMBER: XC6804A3E1QR-G; VENDOR: Torex Semiconductor Ltd
U2 = Eagle Part Library:LMR62421XSDE/NOPB: IC REG BST SEPIC ADJ 2.1A 6WSON Source: Datasheet <https://www.ti.com/lit/ds/symlink/lmr62421.pdf?HQS=dis-dk-null-digikeymode-dsf-pf-null-wwe&ts=1620874435898&ref_url=https%253A%252F%252Fwww.digikey.hk%252F>; MANUFACTURER_PART_NUMBER: LMR62421XSDE/NOPB; VENDOR: Texas Instruments
U3 = Eagle Part Library:NCP161BMX330TBG: IC REG LINEAR 3.3V 450MA 4XDFN
U4 = Eagle Part Library:SHT30-DIS: Digital Humidity & Temperature Sensor
U5 = Eagle Part Library:NRF52832-QFAA-R: IC RF TXRX+MCU BLUETOOTH 48QFN Source: Datasheet <http://infocenter.nordicsemi.com/pdf/nRF52832_PS_v1.4.pdf>; MANUFACTURER_PART_NUMBER: NRF52832-QFAA-R; VENDOR: Nordic Semiconductor ASA
U6 = Eagle Part Library:BMI160: IMU ACCEL/GYRO I2C/SPI 14LGA Source: Datasheet <https://www.bosch-sensortec.com/media/boschsensortec/downloads/datasheets/bst-bmi160-ds000.pdf>; MANUFACTURER_PART_NUMBER: BMI160; VENDOR: Bosch Sensortec
U7 = Eagle Part Library:74LVCH2T45GT,115: IC TRNSLTR BIDIRECTIONAL 8XSON
U$4 = Eagle Part Library:BCD-LOGO: BCD LOGO
U$5 = Eagle Part Library:ANTI-STATIC: Anti-static
U$6 = Eagle Part Library:OSHW-LOGO-R2000: OSHW-Logo-R2000
VR1 = Eagle Part Library:3314J-1-103E: TRIMMER 10K OHM 0.25W J LEAD TOP Source: Datasheet <https://www.bourns.com/docs/Product-Datasheets/3314.pdf>; MANUFACTURER_PART_NUMBER: 3314J-1-103E; VENDOR: Bourns Inc
Y1 = Eagle Part Library:7V-32.000MDDE-T: CRYSTAL 32.0000MHZ 12PF SMD Source: Datasheet <http://www.txccrystal.com/images/pdf/7v.pdf>; MANUFACTURER_PART_NUMBER: 7V-32.000MDDE-T; VENDOR: TXC CORPORATION
Y2 = Eagle Part Library:9HT11-32.768KDZF-T: CRYSTAL 32.7680KHZ 12.5PF SMD Source: Datasheet <http://www.txccrystal.com/images/pdf/9ht11.pdf>; MANUFACTURER_PART_NUMBER: 9HT11-32.768KDZF-T; VENDOR: TXC CORPORATION

## Board
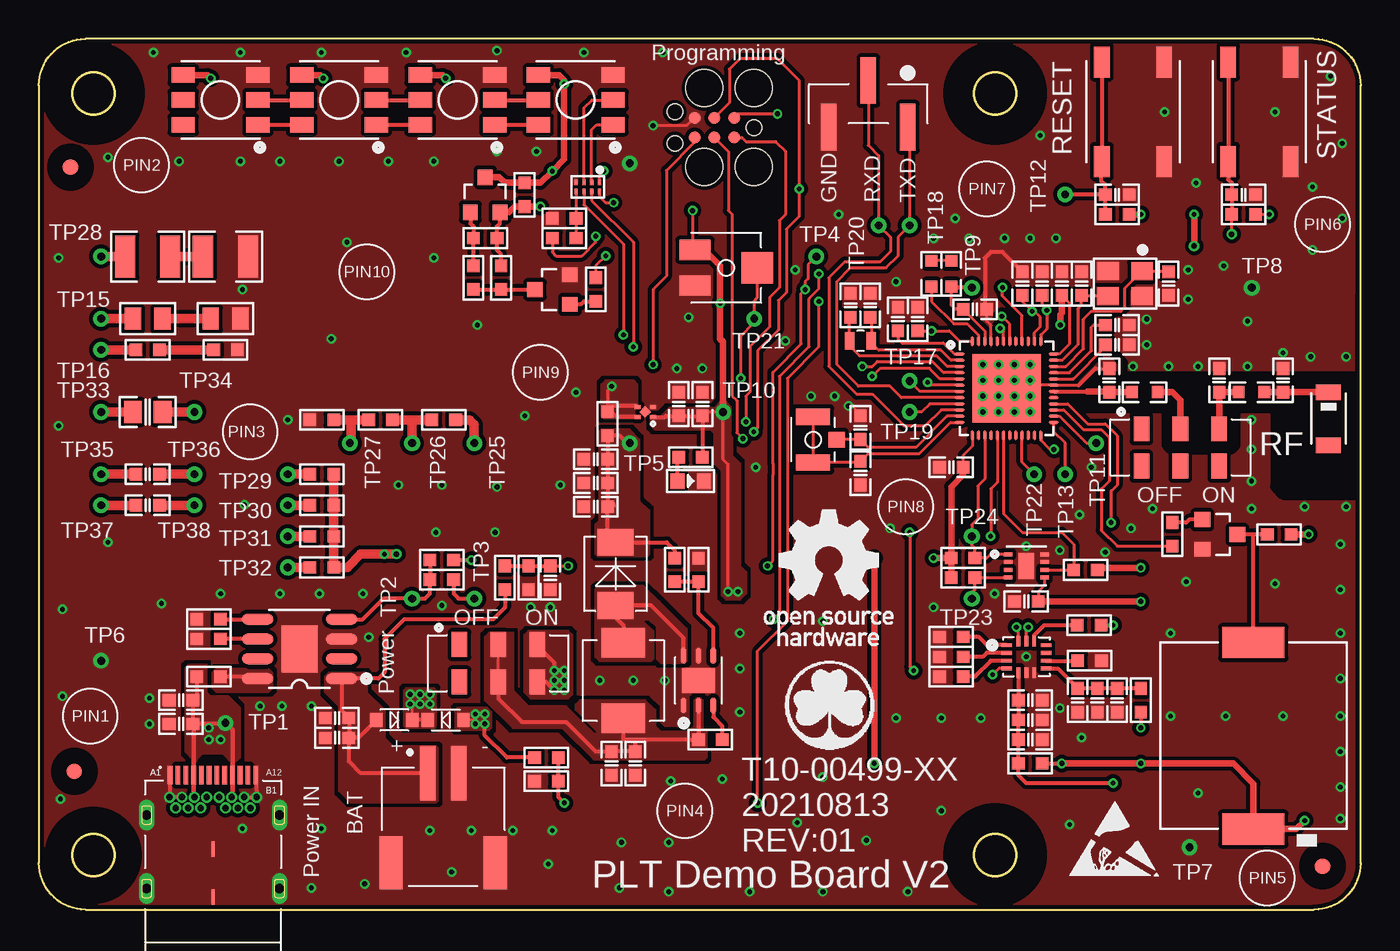
[diagram p4: board, top side]
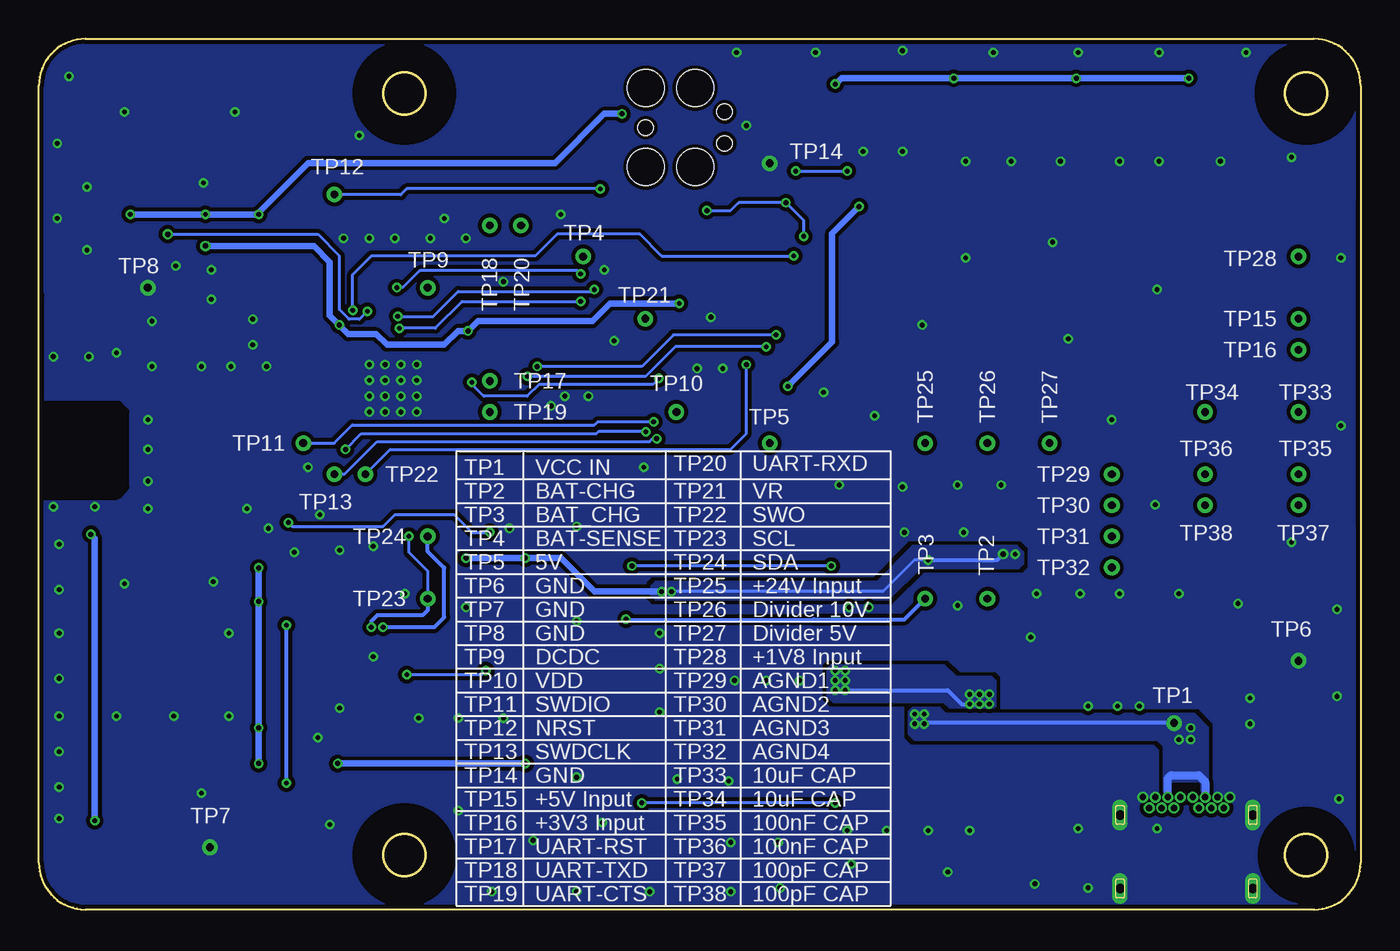
[diagram p5: board, bottom side, seen from below]

Size 85 x 56 mm. Coordinates in mm from the lower left corner, seen from the top.
Outline: 3,0 82,0 arc90 85,3 85,53 arc90 82,56 3,56 arc90 0,53 0,3 arc90 3,0
Outline: circle at 3.5,3.5 radius 1.35
Outline: circle at 3.5,52.5 radius 1.35
Outline: circle at 61.5,52.5 radius 1.35
Outline: circle at 61.5,3.5 radius 1.35
Copper layers (1*16): Top 0.035mm / dielectric 1.5mm / Bottom 0.035mm
Design rules "default *": minimum track width 6mil, minimum drill 6mil, track to track 4mil, track to pad 4mil, pad to pad 6mil, via to via 6mil, smd to smd 2mil, copper to edge 8mil, drill to drill 6mil, minimum pad ring 6mil, minimum via ring 6mil, stop-mask expansion 4mil, vias tented up to drill 12mil, thermal gap 10mil
tRestrict: area 0.7,0.7 to 6.3,6.3; area 58.5,0.5 to 64.5,6.5; area 58.5,49.5 to 64.5,55.5; area 0.5,49.5 to 6.5,55.5; 31 lines
bRestrict: area 0.7,0.7 to 6.3,6.3; area 58.5,0.5 to 64.5,6.5; area 58.5,49.5 to 64.5,55.5; area 0.5,49.5 to 6.5,55.5; 7 lines

### Footprints (pad centres in the part's own frame; a part is rotated, then mirrored left to right if it is on the bottom)
ANT_3216 = smd 1 x 1.6: 1 -1.7,0; 2 1.7,0
C0603 = smd 0.813 x 0.787: 1 -0.762,0; 2 0.762,0
C0805 = smd 1.15 x 1.4: 1 -0.95,0; 2 0.95,0
SMB = smd 1.727 x 2.286: 1 -2.032,0; 2 2.032,0
LED5X5-6N = smd 1.5 x 1: 1 -2.4,1.6; 2 -2.4,0; 3 -2.4,-1.6; 4 2.4,-1.6; 5 2.4,0; 6 2.4,1.6
LED0603 = smd 0.9 x 1: 1 -0.85,0; 2 0.85,0
SOD-323 = smd 0.8 x 0.9: 1 1.15,0; 2 -1.15,0
SENSOR_MISC_FIDUCIAL-1MM = smd 1 x 1: F 0,0
632723X00011 = smd 0.3 x 1.2: A1 -2.75,4.75; A2 -2.25,4.75; A3 -1.75,4.75; A4 -1.25,4.75; A5 -0.75,4.75; A6 -0.25,4.75; A7 0.25,4.75; A8 0.75,4.75; A9 1.25,4.75; A10 1.75,4.75; A11 2.25,4.75; A12 2.75,4.75 | drill 0.4 pad 0.65: B1 2.8,3.33; B2 2.4,2.63; B3 1.6,2.63; B4 1.2,3.33; B5 0.8,2.63; B6 0.4,3.33; B7 -0.4,3.33; B8 -0.8,2.63; B9 -1.2,3.33; B10 -1.6,2.63; B11 -2.4,2.63; B12 -2.8,3.33; GND 2,3.33; GND1 -2,3.33 | drill 0.6 pad 1 long: S1 -4.27,2.18; S2 4.27,2.18; S3 4.27,-2.55; S4 -4.27,-2.55 | smd 0.2 x 1: S5 0,0; S6 0,-3.1
S2B-PH-SM4-TB(LF)(SN) = smd 1 x 3.5: 1 -1,0; 2 1,0 | smd 1.5 x 3.4: S1 -3.35,-5.75; S2 3.35,-5.75
U.FL-R-SMT(10) = smd 1.05 x 1: 1 -1.525,0 | smd 2.2 x 1.05: 2 0,1.475; 3 0,-1.475
JMP254P1X3V-SMT = smd 3 x 1: 1 -1.5,-2.54; 2 1.5,0; 3 -1.5,2.54
IND-5220_SMD = smd 1.9 x 2.8: 1 -2.425,0; 2 2.425,0
IND-0603 = smd 0.75 x 0.78: 1 -0.83,0; 2 0.83,0
TC2030-IDC = smd 0.787 x 0.787: 1 -1.27,-0.635; 2 -1.27,0.635; 3 0,-0.635; 4 0,0.635; 5 1.27,-0.635; 6 1.27,0.635 | hole 0.991: -2.54,0; 2.54,1.016; 2.54,-1.016 | hole 2.375: -2.54,2.54; -2.54,-2.54; 0.635,2.54; 0.635,-2.54
SOT23 = smd 0.95 x 1: 1 -0.95,-1.125; 2 0.95,-1.125; 3 0,1.125
R0603 = smd 0.813 x 0.787: 1 -0.762,0; 2 0.762,0
R1210 = smd 1.3 x 2.7: 1 -1.45,0; 2 1.45,0
R0805 = smd 1.05 x 1.4: 1 -0.95,0; 2 0.95,0
SPEAKER12X12_SMT = smd 2 x 4: 1 -6,0; 2 6,0
SWITCH6.5X6_SMD = smd 1 x 2: 1 2,3.2; 2 2,-3.2; 3 -2,3.2; 4 -2,-3.2
JS202011JCQN = smd 1 x 1.6: 1 -2.5,1.2; 2 0,1.2; 3 2.5,1.2; 4 -2.5,-1.2; 5 0,-1.2; 6 2.5,-1.2
TP1.0X0.5_DIP = drill 0.5 pad 1: 1 0,0
SOP127P6X1.6-8NP = smd 2 x 0.7: 1 -2.7,1.905; 2 -2.7,0.635; 3 -2.7,-0.635; 4 -2.7,-1.905; 5 2.7,-1.905; 6 2.7,-0.635; 7 2.7,0.635; 8 2.7,1.905 | smd 2.3 x 3: 9 0,0
WSON095P3X3-6NPAD = smd 1 x 0.35: 1 -1.6,0.95; 2 -1.6,0; 3 -1.6,-0.95; 4 1.6,-0.95; 5 1.6,0; 6 1.6,0.95 | smd 1.6 x 2.1: 7 0,0
XDFN4 = smd 0.26 x 0.39: 1 -0.325,-0.5; 2 0.325,-0.5; 3 0.325,0.5; 4 -0.325,0.5 | smd 0.52 x 0.52 rotated 45: 5 0,0
DFN050P2.5X2.5-8N = smd 0.55 x 0.25: 1 -1.175,0.75; 2 -1.175,0.25; 3 -1.175,-0.25; 4 -1.175,-0.75; 5 1.175,-0.75; 6 1.175,-0.25; 7 1.175,0.25; 8 1.175,0.75 | smd 1 x 1.7: 9 0,0
QFN040P6X6-48NV = smd 0.65 x 0.2: 1 -3.025,2.2; 2 -3.025,1.8; 3 -3.025,1.4; 4 -3.025,1; 5 -3.025,0.6; 6 -3.025,0.2; 7 -3.025,-0.2; 8 -3.025,-0.6; 9 -3.025,-1; 10 -3.025,-1.4; 11 -3.025,-1.8; 12 -3.025,-2.2; 25 3.025,-2.2; 26 3.025,-1.8; 27 3.025,-1.4; 28 3.025,-1; 29 3.025,-0.6; 30 3.025,-0.2; 31 3.025,0.2; 32 3.025,0.6; 33 3.025,1; 34 3.025,1.4; 35 3.025,1.8; 36 3.025,2.2 | smd 0.2 x 0.65: 13 -2.2,-3.025; 14 -1.8,-3.025; 15 -1.4,-3.025; 16 -1,-3.025; 17 -0.6,-3.025; 18 -0.2,-3.025; 19 0.2,-3.025; 20 0.6,-3.025; 21 1,-3.025; 22 1.4,-3.025; 23 1.8,-3.025; 24 2.2,-3.025; 37 2.2,3.025; 38 1.8,3.025; 39 1.4,3.025; 40 1,3.025; 41 0.6,3.025; 42 0.2,3.025; 43 -0.2,3.025; 44 -0.6,3.025; 45 -1,3.025; 46 -1.4,3.025; 47 -1.8,3.025; 48 -2.2,3.025 | smd 4.4 x 4.4: 49 0,0 | drill 0.305 pad 0.61: P$1 -1.524,1.524; P$2 -0.508,1.524; P$3 0.508,1.524; P$4 1.524,1.524; P$5 -1.524,0.508; P$6 -0.508,0.508; P$7 0.508,0.508; P$8 1.524,0.508; P$9 -1.524,-0.508; P$10 -0.508,-0.508; P$11 0.508,-0.508; P$12 1.524,-0.508; P$13 -1.524,-1.524; P$14 -0.508,-1.524; P$15 0.508,-1.524; P$16 1.524,-1.524
LGA050P3X2.5-14N = smd 0.675 x 0.25: 1 -1.262,0.75; 2 -1.262,0.25; 3 -1.262,-0.25; 4 -1.262,-0.75; 8 1.262,-0.75; 9 1.262,-0.25; 10 1.262,0.25; 11 1.262,0.75 | smd 0.25 x 0.675: 5 -0.5,-1.012; 6 0,-1.012; 7 0.5,-1.012; 12 0.5,1.012; 13 0,1.012; 14 -0.5,1.012
XSON8-SOT833-1 = smd 0.35 x 0.2: 1 -0.3,0.75; 2 -0.3,0.25; 3 -0.3,-0.25; 4 -0.3,-0.75; 5 0.3,-0.75; 6 0.3,-0.25; 7 0.3,0.25; 8 0.3,0.75
3314J-1-103E = smd 1.3 x 2: 1 1.15,-2; 3 -1.15,-2 | smd 2 x 2: 2 0,2
OSC3.2X2.5-4N = smd 1.4 x 1.15: 1 -1.1,-0.8; 2 1.1,-0.8; 3 1.1,0.8; 4 -1.1,0.8
OSC2X1.2-2N = smd 0.61 x 1.1: 1 -0.7,0; 2 0.7,0

### Placement (x,y rotation side)
ANT1  82.93,31.57 270 top
C1  9.14,11.94 180 top
C2  9.14,13.46 180 top
C3  19.18,11.05 180 top
C4  19.18,12.32 180 top
C5  32.89,21.34 270 top
C6  63.25,40.26 90 top
C7  38.35,9.4 270 top
C8  36.83,9.4 270 top
C9  35.81,25.91 180 top
C10  35.81,27.43 180 top
C11  35.81,28.96 180 top
C12  42.67,32.51 90 top
C13  41.15,32.51 90 top
C14  60.2,38.61 0 top
C15  77.47,45.97 0 top
C16  67.06,40.26 90 top
C17  56.52,37.97 90 top
C18  55.24,37.97 270 top
C19  72.64,40.26 270 top
C20  65.79,40.26 90 top
C21  53.47,38.86 270 top
C22  69.34,37.59 0 top
C23  52.2,38.86 270 top
C24  69.34,36.32 0 top
C25  68.83,34.04 90 top
C26  75.91,34.04 90 top
C27  58.67,28.45 180 top
C28  69.34,45.97 0 top
C29  52.83,30.99 90 top
C30  52.83,28.07 270 top
C31  63.75,10.92 0 top
C32  63.75,12.19 0 top
C33  64.52,40.26 90 top
C34  80.01,34.04 90 top
C35  63.75,13.46 0 top
C36  66.8,13.46 270 top
C37  68.07,13.46 270 top
C38  69.34,13.46 270 top
C39  63.5,19.81 0 top
C42  7,32 0 top
C43  7,28 0 top
C44  7,26 0 top
D1  37.08,21.59 90 top
D4  34.52,52.07 180 top
D5  26.92,52.07 180 top
D6  19.3,52.07 180 top
D7  11.68,52.07 180 top
D8  41.91,27.56 0 top
D9  22.86,12.19 180 top
D10  26.16,12.19 0 top
FID1  2.29,8.89 0 top
FID2  82.55,2.79 0 top
FID3  2.03,47.75 0 top
J1  11.2,3.9 0 top
J2  26,8.76 0 top
J3  49.78,30.23 180 top
JP1  53.34,51.82 90 top
L1  37.59,14.73 90 top
L3  58.67,40.89 90 top
L4  57.4,40.89 270 top
L5  71.12,33.27 0 top
L6  77.98,33.27 0 top
P1  43.43,50.29 180 top
PIN1  3.3,12.45 0 top
PIN2  6.6,47.88 0 top
PIN3  13.59,30.73 0 top
PIN4  41.53,6.35 0 top
PIN5  78.99,2.03 0 top
PIN6  82.55,44.07 0 top
PIN7  60.96,46.35 0 top
PIN8  55.75,25.91 0 top
PIN9  32.26,34.54 0 top
PIN10  21.08,41.02 0 top
Q1  75.95,24.13 270 top
Q2  33.02,39.88 90 top
Q3  28.7,45.97 0 top
R1  29.97,21.34 270 top
R2  31.5,21.34 90 top
R3  10.92,18.67 0 top
R4  79.76,24.13 0 top
R5  72.9,24.13 90 top
R6  36.58,31.24 270 top
R7  41.91,29.08 0 top
R8  40.89,21.84 90 top
R9  42.42,21.84 270 top
R10  43.18,10.92 180 top
R11  77.47,44.7 0 top
R12  10.92,17.4 0 top
R13  58.67,17.53 180 top
R14  69.34,44.7 180 top
R15  63.75,9.4 0 top
R16  67.54,18.29 180 top
R17  67.56,16 180 top
R18  70.87,13.46 270 top
R20  33.78,43.18 180 top
R21  33.78,44.45 0 top
R22  32.64,9.78 180 top
R23  32.64,8.26 0 top
R24  25.91,22.48 0 top
R25  25.91,21.21 180 top
R28  35.81,39.88 90 top
R29  29.72,40.64 90 top
R30  27.94,40.64 270 top
R31  28.7,43.18 180 top
R32  31.24,45.97 270 top
R33  67.31,21.84 0 top
R34  59.44,22.61 180 top
R35  59.44,21.34 180 top
R43  10.92,14.99 180 top
R46  58.67,16.26 180 top
R47  58.67,14.99 180 top
R48  26.04,31.5 0 top
R49  21.97,31.5 0 top
R50  18.2,31.5 0 top
R51  7,42 180 top
R52  7,38 180 top
R53  7,36 180 top
R54  12,42 180 top
R55  12,38 180 top
R56  12,36 180 top
R57  18.2,28 0 top
R58  18.2,26 0 top
R59  18.2,24 0 top
R60  18.2,22 0 top
SP1  78.11,11.18 90 top
SW1  78.49,51.31 180 top
SW2  70.36,51.31 180 top
SW3  73.41,29.72 0 top
SW4  29.54,15.84 0 top
TP1  12,12 0 bottom
TP2  24,20 0 bottom
TP3  28,20 270 bottom
TP4  50,42 0 bottom
TP5  38,30 270 bottom
TP6  4,16 0 bottom
TP7  74,4 0 bottom
TP8  78,40 0 bottom
TP9  60,40 0 bottom
TP10  44,32 0 bottom
TP11  68,30 0 bottom
TP12  66,46 0 bottom
TP13  66,28 0 bottom
TP14  38,48 0 bottom
TP15  4,38 0 bottom
TP16  4,36 0 bottom
TP17  56,34 0 bottom
TP18  56,44 270 bottom
TP19  56,32 0 bottom
TP20  54,44 270 bottom
TP21  46,38 90 bottom
TP22  64,28 0 bottom
TP23  60,20 0 bottom
TP24  60,24 0 bottom
TP25  28,30 0 bottom
TP26  24,30 0 bottom
TP27  20,30 0 bottom
TP28  4,42 0 bottom
TP29  16,28 0 bottom
TP30  16,26 0 bottom
TP31  16,24 0 bottom
TP32  16,22 0 bottom
TP33  4,32 0 bottom
TP34  10,32 0 bottom
TP35  4,28 0 bottom
TP36  10,28 0 bottom
TP37  4,26 0 bottom
TP38  10,26 0 bottom
U1  16.76,16.76 180 top
U2  42.42,14.73 90 top
U3  38.99,32 90 top
U4  63.5,22.1 0 top
U5  62.23,33.53 0 top
U6  63.5,16.26 0 top
U7  35.31,46.48 270 top
U$4  50.8,13.21 0 top
U$5  69.22,4.32 0 top
U$6  50.8,22.61 0 top
VR1  44.2,41.27 270 top
Y1  69.85,40.26 180 top
Y2  52.83,36.58 180 top

### Tracks (layer width: path | path; a pad name or v marks a point on that pad's centre or on a via)
5V  (via drill 0.3)
  Top 0.203: v36.83,33.66 36.58,33.4 R6.1
  Top 0.254: U3.4 37.16,31.68 36.58,32.26 | R6.1 36.58,32.38 38.43,32.38 U3.3 | R29.2 29.72,42.16 29.46,42.42 R31.1 29.46,43.94 29.65,44.13 Q3.2 | 30.99,45.21 R32.2
  Top 0.406: Q3.2 30.24,44.85 30.61,45.21 30.99,45.21 v32.26,45.21
  Bottom 0.406: v36.83,33.66 33.98,36.5 33.98,43.48 v32.26,45.21
  pour Top (isolate 0.254, no thermals): 37.97,34.04 36.45,34.04 36.2,33.78 36.2,31.75 36.32,31.62 38.35,31.62 38.35,32.26 38.48,32.38 38.48,33.78 38.23,34.04
5V_LED  (via drill 0.3)
  Top 0.203: 33.78,53.34 v33.78,53.09 | U7.1 36.06,47.23 v36.32,47.5
  Top 0.406: D4.4 33.45,53.67 33.78,53.34 | v33.78,53.09 33.78,48.26 v33.02,47.5 32.26,46.74 R32.1 29.97,46.74 29.61,47.1 Q3.3 | D7.4 10.85,53.67 v11.05,53.47 | D6.4 18.09,53.67 v18.29,53.47 | D5.4 25.96,53.67 v26.16,53.47
  Bottom 0.203: v36.32,47.5 v33.02,47.5
  Bottom 0.406: v11.05,53.47 v18.29,53.47 v26.16,53.47 33.4,53.47 v33.78,53.09
+1V8OUT
  Top 0.61: R51.2 TP28.1
+3V3OUT
  Top 0.61: TP16.1 R53.2
+5VOUT
  Top 0.61: TP15.1 R52.2
+24V
  Top 0.61: TP25.1 28,31.18 27.69,31.5 R48.2
AGND1
  Top 0.61: R57.1 TP29.1
AGND2
  Top 0.61: R58.1 TP30.1
AGND3
  Top 0.61: R59.1 TP31.1
AGND4
  Top 0.61: R60.1 TP32.1
BAT
  Top 0.254: C3.1 C4.1 19.46,12.79 U1.1 21.84,14.86 22.23,15.24 22.23,17.4 23.5,18.67 29.21,18.67 29.97,19.43 R1.2 | J2.1 20.7,8.76 19.94,9.53 C3.1 | D9.1 20.57,11.05 C3.1
  pour Top (isolate 0.254, no thermals): 18.67,15.24 20.95,15.24 21.08,15.11 21.08,13.97 22.23,12.83 22.23,11.05 22.73,10.54 25.53,10.54 25.65,10.41 25.65,6.99 25.53,6.86 20.07,6.86 19.3,7.62 19.3,13.08 18.8,13.59 18.41,13.97 18.41,14.73 18.41,14.99
BAT_CHGB  (via drill 0.3)
  Top 0.203: U5.40 63.23,38.19 61.98,39.45 v61.98,40.01 | v47.24,18.67 47.62,19.05 47.62,34.29 49.53,36.2 49.53,39.29 50.16,39.93 v50.16,40.89
  Top 0.254: R25.1 26.67,20.32 26.99,20 TP3.1
  Bottom 0.203: v47.24,18.67 35.18,18.67 | v61.98,40.01 61.59,40.01 60.52,41.08 50.35,41.08 v50.16,40.89
  Bottom 0.254: 35.18,18.67 29.33,18.67 TP3.1
BAT_CHGB2
  Top 0.254: R24.1 R25.2 25.15,20.32 24.83,20 TP2.1 22.16,20 20.83,18.67 U1.4
BAT_SENSE  (via drill 0.3)
  Top 0.203: U5.42 62.43,37.65 v61.92,38.15 | v46.86,22.1 47.19,22.43 47.19,27.18 47.19,27.94 47.19,28.7 47.19,34.54 49.02,36.37 49.02,39.62 v49.28,39.88 49.28,40.39 49.47,40.58 49.47,41.47 TP4.1 | C5.1 v34.04,22.1
  Top 0.254: R1.1 R2.2 C5.1
  Bottom 0.203: v34.04,22.1 v46.86,22.1 | v61.92,38.15 59.64,38.15 58.04,39.75 49.4,39.75 v49.28,39.88
BUTTON1  (via drill 0.3, 0.35)
  Top 0.203: U5.38 64.03,37.12 64.4,37.48 64.4,38.09 64.01,38.48 v63.88,38.48 63.25,39.12 C6.1 | v76.71,43.43 R11.1
  Top 0.254: SW1.2 SW1.1 76.49,46.96 76.71,46.74 C15.1 R11.1
  Bottom 0.203: v76.71,43.43 67.06,43.43 65.66,42.04 65.66,38.58 65.05,37.97 64.39,37.97 v63.88,38.48
BUZZER
  Top 0.203: U5.27 65.92,32.13 67.18,30.86 68.33,30.86 68.83,30.35 68.83,27.56 68.33,27.05 68.33,24.38 69.34,23.37 R5.1
DCDC
  Top 0.203: L3.1 58.67,38.86 58.93,38.61 C14.1 60.83,37.21 U5.46
  Top 0.254: TP9.1 58.74,40 L3.1
GND  (via drill 0.3)
  Top 0.152: C29.2 52.83,31.88 52.32,32.38 v52.07,32.38 | v72.77,17.78 72.64,17.78
  Top 0.203: 66.88,33.73 U5.31 63.95,33.73 U5.P$15 | 67.94,34.8 C25.2 | U5.45 61.23,37.58 60.96,37.85 C14.2 | P1.5 41.66,50.42 v39.5,50.42
  Top 0.254: 66.88,33.73 67.94,34.8 | C6.2 61.98,42.29 61.21,42.29 60.83,41.91 60.83,38.73 C14.2 | J1.GND1 J1.B12 8.45,9.12 J1.A1 | J1.GND J1.B1 13.95,9.12 J1.A12
  other vias: 51.18,33.02 70.36,34.92 72.64,34.92 74.55,34.92 77.72,34.92 71.25,37.97 84.07,35.56 77.72,37.85 71.25,36.32 77.98,31.5 80.01,35.81 74.42,46.74 58.93,44.45 48.64,41.15 71.63,25.78 54.74,24.51 66.93,25.4 67.69,28.45 57.53,43.18 59.82,43.18 62.1,43.18 63.75,43.18 76.2,41.4 73.91,39.24 48.01,36.58 77.98,25.78 77.98,27.56 77.98,29.59 84.07,25.91 83.69,5.84 83.69,7.87 83.69,10.16 83.69,12.45 83.69,14.86 83.69,17.78 83.69,20.57 83.69,23.5 50.42,24.64 50.42,1.14 53.21,4.45 50.42,8.51 1.4,7.11 50.42,18.54 58.04,6.35 55.88,1.14 48.77,5.59 45.72,1.14 40.51,4.32 40.51,1.14 32.77,2.92 37.34,1.4 43.94,8.38 40.64,8.26 45.09,17.78 45.09,15.49 45.09,12.7 40.26,14.73 32.89,19.43 31.62,19.43 36.07,14.73 38.23,14.73 37.47,4.32 17.53,1.4 13.08,5.21 25.15,5.08 17.53,13.08 18.16,5.21 27.81,5.08 46.1,28.45 15.62,13.08 30.48,5.08 14.22,13.08 21.21,17.53 33.02,5.08 20.95,1.65 26.54,2.41 1.27,41.91 4.45,23.62 19.81,42.93 13.08,39.88 1.27,31.11 34.54,33.27 1.52,19.3 25.4,41.91 13.21,26.04 7.11,13.59 7.11,11.94 1.52,13.72 7.87,19.68 25.91,19.56 18.03,20.32 15.49,20.32 11.68,20.32 31.24,31.75 29.34,24.26 25.53,24.26 20.83,20.32 4.45,48.39 32,48.77 29.46,48.77 23.11,27.3 25.4,48.13 22.48,48.13 19.3,48.13 15.49,48.13 12.95,48.13 9.02,48.13 33.53,27.3 29.46,27.18 18.8,36.7 25.91,27.3 16,31.5 28.19,37.59 41.78,38.1 42.67,34.8 41.02,34.8 79.5,51.31 83.06,53.59 83.82,49.28 81.92,46.48 83.82,44.45 81.79,35.56 81.92,42.42 72.39,51.31 81.41,25.91 7.37,55.12 12.95,55.12 18.16,55.12 23.62,55.12 29.46,55.24 35.05,55.12 40.13,55.12 79.5,20.95 74.55,7.49 80.01,12.45 76.33,12.45 72.77,12.45 60.58,12.32 67.06,11.05 55.12,12.32 65.66,12.95 58.04,12.32 73.79,21.08 57.53,19.43 68.58,22.99 63.5,23.37 61.47,20.32 65.66,23.11 63.5,16.26 66.29,5.46 51.44,44.7 73.91,41.15 64.39,49.78 65.41,43.18 55.12,40.39 70.23,24.51 49.66,33.02
  pour Top (isolate 0.254, rank 2, no thermals): 3.05,0 82.04,0 arc90 84.96,2.92 84.96,3.17 84.96,52.96 arc90 81.92,56.01 80.14,56.01 2.92,56.01 arc90 0,53.09 0,51.18 0,2.92 arc90 2.92,0
  pour Bottom (isolate 0.254, rank 2, no thermals): 3.05,0 81.92,0 arc90 85.01,3.1 85.01,3.25 85.01,52.63 arc90 81.64,56.01 80.77,56.01 2.79,56.01 arc90 0,53.21 0,52.07 0,2.92 arc90 2.92,0
I2C_SCL  (via drill 0.3)
  Top 0.203: U4.4 62.31,21.34 R35.1 60.2,20.57 60,20.38 TP23.1 | U6.13 63.5,18.03 v63.63,18.16 | U5.17 61.63,27.47 61.21,27.05 v61.21,24
  Bottom 0.203: v61.21,24 61.21,22.99 60,21.77 TP23.1
  Bottom 0.254: TP23.1 60,19.25 60.33,18.92 63.25,18.92 63.63,18.54 v63.63,18.16
I2C_SDA  (via drill 0.3)
  Top 0.203: U4.1 61.2,22.85 60.96,22.61 R34.1 60.2,23.24 60,23.44 TP24.1 60,24.76 60.38,25.14 60.38,27.23 60.83,27.68 U5.15 | U6.14 63,18.03 v62.87,18.16
  Bottom 0.254: v62.87,18.16 59.56,18.16 58.93,18.8 58.93,21.97 60,23.04 TP24.1
INT1  (via drill 0.3)
  Top 0.203: v68.96,24.89 68.96,26.92 69.34,27.3 69.34,30.48 68.58,31.24 67.45,31.24 66.17,32.53 U5.28 | U6.4 61.73,15.51 v61.34,15.11 | v56.01,24.26 56.01,15.62 v56.26,15.37
  Bottom 0.203: v68.96,24.89 68.71,24.64 62.87,24.64 62.1,25.4 58.29,25.4 57.15,24.26 v56.01,24.26 | v61.34,15.11 56.52,15.11 v56.26,15.37
N$1
  Top 0.254: U6.3 61.22,16.01 60.2,14.99 R47.1
N$2
  Top 0.254: L1.2 37.59,18.29 37.08,18.8 D1.1 39.37,19.56 41.47,17.46 U2.6
  pour Top (isolate 0.254, no thermals): 35.81,20.57 35.81,16.26 36.07,16 39.37,16 39.5,16.13 39.5,17.91 38.86,18.54 38.99,18.67 39.24,18.67 39.75,18.16 39.75,16.13 39.88,16 40.01,15.88 41.53,15.88 41.66,16 41.66,18.03 39.88,19.81 38.86,20.83 36.07,20.83
N$3
  Top 0.152: SW4.2 SW4.5
  Top 0.254: 38.35,10.92 C7.1 C8.1 35.81,10.16 33.91,12.06 31.07,12.06 29.54,13.59 SW4.5 | L1.1 37.59,10.92 38.35,10.92 | U2.2 R10.2 38.35,10.92
  pour Top (isolate 0.254, no thermals): 28.96,17.78 30.48,17.78 30.48,14.1 31.5,13.08 33.91,13.08 35.69,11.3 35.94,11.3 35.94,11.43 34.54,12.83 34.54,13.21 34.8,13.46 38.99,13.46 39.62,12.83 39.62,11.81 40.01,11.43 41.78,11.43 42.16,11.81 42.16,13.46 42.29,13.59 42.55,13.59 42.67,13.46 42.67,11.68 42.93,11.43 42.93,9.78 42.8,9.65 35.69,9.65 33.66,11.68 30.48,11.68 28.7,13.46 28.7,17.53
N$4
  Top 0.254: U2.3 43.37,12.38 43.94,11.81 R10.1
N$5
  Top 0.254: R3.2 U1.5
N$6
  Top 0.254: R43.1 14.06,14.99 U1.8
  pour Top (isolate 0.254, no thermals): 11.43,15.49 14.73,15.49 14.99,15.24 14.99,14.22 14.73,13.97 11.43,13.97 11.18,14.22 11.18,15.24
N$7
  Top 0.254: U2.4 43.37,18.1 42.42,19.05 R9.2 R8.1
N$8
  Top 0.254: R8.2 40.89,23.11 40.38,23.62 D1.2 36.58,24.13 C9.1 | C9.1 36.92,26.14 37.08,25.97 | C9.1 C10.1 C11.1 R6.2 37.34,30.48 37.82,30 TP5.1
  pour Top (isolate 0.254, no thermals): 37.97,30.86 36.2,30.86 36.07,30.73 36.07,25.02 35.81,24.77 35.81,22.86 35.94,22.73 39.12,22.73 39.24,22.86 39.24,25.65 38.61,26.29 38.61,30.23
N$9
  Top 0.203: U5.1 58.89,35.73 58.17,36.45 55.5,36.45 55.24,36.7 C18.2
N$10
  Top 0.203: C21.2 53.53,38.03 Y2.1 53.53,36.44 53.99,35.98 58,35.98 58.65,35.33 U5.2
N$11
  Top 0.254: D8.1 41.06,29 R7.1
N$12
  Top 0.254: U1.6 R12.2
N$13
  Top 0.254: R30.2 R29.1 Q2.3
N$14
  Top 0.254: Q2.1 34.86,38.93 35.05,39.12 R28.1
N$15
  Top 0.254: R30.1 R31.2 27.94,43.94 27.75,44.13 Q3.1
N$16
  Top 0.203: U5.3 58.42,34.93 57.72,35.62 52.77,35.62 52.13,36.26 Y2.2 52.13,38.03 C23.2
N$17
  Top 0.203: J3.3 J3.2 52.75,28.75 C30.1 53.34,29.34 56.64,29.34 58.63,31.33 U5.12
N$18
  Top 0.203: U5.11 58.4,31.73 56.39,29.72 53.34,29.72 C29.1 J3.1
N$19
  Top 0.254: U6.1 60.97,17.01 60.45,17.53 R13.1
N$20
  Top 0.254: U5.30 67.44,33.33
  Top 0.419: L5.1 C25.1 68.78,33.33 67.44,33.33
N$21
  Top 0.203: L3.2 L4.1
N$22
  Top 0.203: L4.2 57.4,39.12 58.84,37.68 59.69,37.68 60.43,36.94 U5.47
N$23
  Top 0.203: U7.2 35.56,50.16 35.87,50.47 D4.1
N$24
  Top 0.203: U7.3 35.06,51.57 35.56,52.07 D4.2
N$25
  Top 0.254: D5.1 D4.6
N$26
  Top 0.254: D5.2 D4.5
N$27
  Top 0.254: D6.1 D5.6
N$28
  Top 0.254: D6.2 D5.5
N$29
  Top 0.254: D7.1 D6.6
N$30
  Top 0.254: D7.2 D6.5
N$31
  Top 0.254: U6.9 R17.2
N$32
  Top 0.203: U7.5 34.56,44.46 R21.2 R20.1
N$33
  Top 0.203: U5.35 65.81,35.33 66.8,36.32 66.8,38.61 67.06,38.86 C16.1 68.71,39.5 Y1.3
N$34
  Top 0.254: R4.1 78.11,24.13 | 78.11,24.13 Q1.3 | SP1.2 78.11,24.13
N$35
  Top 0.254: Q1.1 73.97,25.08 73.79,24.89 R5.2
N$36
  Top 0.203: U5.34 66.04,34.93 67.18,36.07 67.18,37.97 67.69,38.48 69.6,38.48 69.85,38.73 69.85,39.96 Y1.1 72.61,41.06 C19.1
N$37
  Top 0.203: U5.33 66.28,34.53 67.69,35.94 67.69,37.47 67.82,37.59 C22.1
N$38
  Top 0.203: U5.32 66.51,34.13 68.58,36.2 C24.1
N$39
  Top 0.419: SW3.2 73.41,32.77 72.9,33.27 L5.2
N$40
  Top 0.419: L6.1 C26.1 SW3.3
N$41
  Top 0.419: L6.2 C34.1 ANT1.1
N$42  (via drill 0.3)
  Top 0.254: U6.5 C35.1 C32.1 C31.1 R15.1 62.99,8.64 63.5,8.13 v69.09,8.13 | R16.1 v69.09,18.29
  Bottom 0.254: v69.09,18.29 v69.09,8.13
N$43
  Top 0.254: R16.2 64.64,18.29 64,17.64 U6.12
N$44
  Top 0.254: R18.1 C38.1 C37.1 C36.1 65.52,15.51 U6.8
N$45
  Top 0.61: R54.2 R51.1
N$46
  Top 0.61: R55.2 R52.1
N$47
  Top 0.61: R56.2 R53.1
N$62
  Top 0.254: U6.2 60.96,16.51 60.71,16.26 R46.1
N$63  (via drill 0.3)
  Top 0.152: v23.88,13.21 24.01,13.07 D9.2
  Top 0.254: SW4.3 32.04,16.98 33.15,15.88 v33.15,15.37 v33.78,15.37 v33.78,14.1 v33.15,14.1 32.6,14.64 SW4.6 | v33.78,14.73 v33.15,14.73 | D10.2 D9.2
  Bottom 0.254: v33.15,14.1 26.54,14.1 25.65,13.21 v25.15,13.21 v24.51,13.21 v24.51,13.84 | v23.88,13.21 v23.88,13.84 v24.51,13.84 | v25.15,13.84 v24.51,13.84
  pour Top (isolate 0.254, no thermals): 23.62,14.22 25.4,14.22 25.53,14.1 25.53,11.81 25.4,11.68 23.62,11.68 23.5,11.81 23.5,14.1
  pour Top (isolate 0.254, no thermals): 31.5,17.91 34.04,17.91 34.29,17.65 34.29,13.84 34.04,13.59 31.62,13.59 31.24,13.97 31.24,17.65
  pour Bottom (isolate 0.254, no thermals): 34.04,15.75 26.8,15.75 26.04,14.99 23.75,14.99 23.5,14.73 23.5,13.08 23.62,12.95 26.42,12.95 26.8,13.34 33.91,13.34 34.29,13.72 34.29,15.49
N$64
  Top 0.61: R50.2 20.07,31.5 | 20.07,31.5 R49.1 | TP27.1 20.07,30.07 20.07,31.5
N$65
  Top 0.61: R49.2 24,31.5 | 24,31.5 R48.1 | TP26.1 24,31.5
N$72
  Top 0.61: C42.2 TP34.1
N$73
  Top 0.61: C42.1 TP33.1
N$74
  Top 0.61: C43.2 TP36.1
N$75
  Top 0.61: C43.1 TP35.1
N$76
  Top 0.61: C44.2 TP38.1
N$77
  Top 0.61: C44.1 TP37.1
NRST  (via drill 0.3)
  Top 0.203: v65.28,29.59 65.02,29.59 64.43,30.18 U5.24 | P1.3 44.4,51.89 44.4,54.05 45.09,54.74 47.5,54.74 48.9,53.34 v48.9,46.35 48.9,44.58 48.07,43.75 48.07,39.69 47.56,39.18 47.56,37.27 46.23,35.94 46.23,30.99 v45.97,30.73
  Top 0.254: SW2.2 SW2.1 68.33,48.08 68.33,46.86 68.58,46.61 C28.1 | R14.2 C28.1 | C28.1 66.03,45.97 TP12.1
  Bottom 0.203: v65.28,29.59 64.26,30.61 49.15,30.61 49.02,30.73 v45.97,30.73 | v48.9,46.35 61.34,46.35 61.72,45.97 65.97,45.97 TP12.1
PWR_EN  (via drill 0.3)
  Top 0.203: U5.37 64.43,36.96 64.82,37.35 v64.82,38.53 64.82,38.56 64.52,38.86 C33.1 | v36.45,42.04 35.81,41.4 R28.2
  Bottom 0.203: v64.82,38.53 64.82,40.84 63.63,42.04 53.09,42.04 51.69,43.43 46.35,43.43 44.96,42.04 v36.45,42.04
RGBLED_MOSI  (via drill 0.3)
  Top 0.203: U5.5 57.95,34.13 57.28,34.8 54.1,34.8 v53.59,34.29 | U7.7 35.56,45.6 38.23,42.93 v38.23,36.2
  Bottom 0.203: v38.23,36.2 44.07,36.2 45.97,34.29 v53.59,34.29
RGBLED_SCK  (via drill 0.3)
  Top 0.203: U5.4 58.18,34.53 57.45,35.26 53.92,35.26 53.59,34.92 v52.96,34.92 | U7.6 35.06,45.34 37.59,42.8 v37.59,36.96
  Bottom 0.203: v37.59,36.96 44.2,36.96 46.23,34.92 v52.96,34.92
SHT30_RESET
  Top 0.203: U4.6 R33.1 66.55,23.5 65.79,24.26 63.25,24.26 62.03,25.47 U5.18
SWDCLK  (via drill 0.3)
  Top 0.203: U5.25 65.25,30.76 66,30.01 TP13.1 | P1.4 44.34,48.75 44.34,44.96 44.58,44.72 44.58,33.04 44.9,32.72 44.9,30.67 v45.28,30.29
  Bottom 0.203: TP13.1 65.34,28 63.25,30.1 45.72,30.1 45.53,30.29 v45.28,30.29
SWDIO  (via drill 0.3)
  Top 0.203: U5.26 65.64,31.73 67.36,30 TP11.1 | P1.2 45.21,49.66 45.47,49.4 47.37,49.4 48.01,48.77 48.01,44.7 47.62,44.32 47.62,40.01 46.99,39.37 46.99,37.47 45.72,36.2 45.72,33.27 45.47,33.02 v45.47,31.37
  Bottom 0.203: TP11.1 66.01,30 64.85,31.17 49.28,31.17 49.07,31.37 v45.47,31.37
SWO  (via drill 0.3)
  Top 0.203: TP22.1 63.23,28.77 U5.21 | P1.6 42.16,49.34 40.35,47.53 40.35,40.73 39.5,39.88 v39.5,35.05
  Bottom 0.203: TP22.1 62.41,29.59 40.51,29.59 39.5,30.61 v39.5,35.05
UART_CTS
  Top 0.203: U5.9 57.29,32.53 56.77,32 TP19.1
UART_RTS
  Top 0.203: U5.7 56.67,33.33 TP17.1
UART_RXD
  Top 0.203: JP1.2 53.34,49.15 54,48.49 TP20.1 54.76,43.24 54.76,42.32 54.1,41.66 51.82,41.66 50.8,40.64 50.8,34.92 52.58,33.15 53.59,33.15 55.63,31.11 57.02,31.11 58.04,32.13 U5.10
UART_TXD
  Top 0.203: U5.8 55.46,32.93 54.74,33.66 52.7,33.66 51.31,35.05 51.31,40.39 52.2,41.27 54.48,41.27 55.24,42.04 55.24,43.24 TP18.1 56,49.92 55.88,50.04 JP1.1
USB_DETECT  (via drill 0.3)
  Top 0.203: U5.43 62.03,37.18 v61.82,37.39 | v46.23,6.86 46.23,16.64 48.13,18.54 48.13,34.16 50.16,36.2 v50.16,39.12
  Top 0.254: R22.1 R23.2 33.4,7.24 v33.78,6.86
  Bottom 0.203: v33.78,6.86 v46.23,6.86 | v50.16,39.12 57.78,39.12 59.51,37.39 v61.82,37.39
VBUS  (via drill 0.3)
  Top 0.152: D10.1 28.07,12.19
  Top 0.254: J1.A4 9.95,9.12 | J1.A9 12.45,9.12 | 12.45,11.55 TP1.1 11.94,11.94 C1.1 | 9.95,11.79 C1.1 | R43.2 10.16,13.72 C2.1 C1.1 | v28.68,11.94 28.68,12.03 | v28.68,12.57 v28.07,12.57 28.07,12.19 v28.07,11.94 v28.68,11.94 | R22.2 30.1,9.78 28.68,11.2 v28.68,11.94 | 9.95,7.28 J1.B9 | 12.45,7.28 J1.B4
  Top 0.305: 12.45,11.55 J1.A9 12.45,7.28 | 9.95,11.79 J1.A4 9.95,7.28
  Bottom 0.254: v28.68,11.94 27.94,11.94 27.88,12 TP1.1
  Bottom 0.508: J1.B4 12.4,8.43 12.19,8.64 10.41,8.64 10,8.22 J1.B9
  other vias: 10.92,11.68 10.92,10.92 11.68,10.92
  pour Top (isolate 0.254, no thermals): 10.79,15.75 9.65,15.75 9.4,15.49 9.4,10.16 9.91,9.65 9.91,9.14 10.16,9.4 10.16,9.65 10.54,10.03 11.81,10.03 12.45,9.4 12.45,9.27 12.95,9.78 12.95,12.95 12.19,13.72 11.05,13.72 10.79,13.97
  pour Top (isolate 0.254, no thermals): 26.92,12.95 28.83,12.95 29.08,12.7 29.08,11.68 28.96,11.56 26.92,11.56 26.8,11.68 26.8,12.83
  pour Bottom (isolate 0.254, no thermals): 27.05,12.95 28.83,12.95 29.08,12.7 29.08,11.3 28.7,10.92 13.08,10.92 12.7,10.54 12.7,7.24 12.19,7.24 12.19,8.13 12.06,8.26 10.41,8.26 10.29,8.13 10.29,7.24 9.78,7.24 9.78,11.68 10.67,12.57 26.67,12.57
VDD  (via drill 0.3, 0.35)
  Top 0.203: U5.36 65.64,35.73 66.29,36.39 66.29,38.99 C20.1 | U5.48 59.2,36.55 58.55,37.21 v57.4,37.21 C17.1 | U4.5 64.67,20.86 64.26,20.45 C39.2 | U5.13 60.03,29.8 59.44,29.21 C27.1 | P1.1 44.96,51.18 v47.5,51.18 | v79.12,44.7 R11.2 | 42.67,32 42.68,32 TP10.1 44,28.95 44.32,28.63 v44.32,20.45 | U7.8 36.06,45.86 36.45,45.47 v36.96,45.47 | v42.04,44.96 42.04,42.42 VR1.3 | R20.2 33.02,42.29 33.27,42.04 34.92,42.04 35.81,42.93 v35.81,43.31
  Top 0.254: U3.1 40.25,31.68 40.32,31.75 C13.1 C12.1 | C12.1 42.67,32 | C12.1 R7.2 | R15.2 v65.79,9.4 | R18.2 v70.87,11.68 | R33.2 68.2,21.97 | R24.2 v27.81,22.48
  Top 0.406: C20.1 65.79,38.35 65.68,38.25 v65.68,37.59 | v65.79,9.4 v70.87,9.4 76.8,9.4 78.11,8.1 SP1.1 80.87,5.18 v81.41,5.71 | 68.2,21.97 v70.87,21.97 | R4.2 v81.66,24.13 | R34.2 R35.2 | R34.2 v57.53,22.61 | C27.1 59.44,27.94 58.67,27.18 R34.2 | C39.2 v70.87,19.81 | R14.1 v70.87,44.7 | VR1.3 42.79,42.42 43.81,41.4 v43.81,38.99 43.81,36.7 44,36.52 TP10.1 | v74.3,42.67 v74.3,44.7 | v53.72,9.4 v53.72,22.61
  Top 0.61: R57.2 R58.2 R59.2 R60.2 19.84,22 20.7,22.86 v22.23,22.86 v22.99,22.86
  Bottom 0.203: v70.87,44.7 70.99,44.7 | v42.04,44.96 40.51,44.96 40.01,45.47 v36.96,45.47 35.81,44.32 v35.81,43.31 | v27.81,22.48 28.7,22.48 30.73,20.45 v44.32,20.45 v44.96,20.45
  Bottom 0.254: v22.99,22.86 23.37,22.48 v27.81,22.48
  Bottom 0.406: v70.87,9.4 v70.87,11.68 v70.87,19.81 v70.87,21.97 | v81.66,24.13 81.41,23.88 v81.41,5.71 | v79.12,44.7 v74.3,44.7 70.99,44.7 67.69,48.01 51.82,48.01 48.64,51.18 v47.5,51.18 | v44.96,20.45 49.28,20.45 51.44,22.61 v53.72,22.61 v57.53,22.61 | v65.79,9.4 v53.72,9.4 | v43.81,38.99 48.26,38.99 49.4,37.85 56.77,37.85 v57.4,37.21 58.04,37.21 58.93,36.32 62.61,36.32 63.3,37.01 65.1,37.01 v65.68,37.59 66.29,38.2 66.29,41.66 67.31,42.67 v74.3,42.67
  pour Top (isolate 0.254, no thermals): 45.09,19.94 44.2,19.94 43.94,20.19 43.94,28.19 43.43,28.7 43.43,30.61 43.18,30.86 39.62,30.86 39.37,31.11 39.37,31.62 39.88,31.62 40.51,32.26 43.43,32.26 43.81,32.64 44.2,32.64 44.58,32.26 44.58,29.21 45.09,28.7 45.09,22.1 45.47,21.72 45.47,20.32
  pour Bottom (isolate 0.254, no thermals): 45.59,20.83 45.59,20.19 45.34,19.94 30.35,19.94 28.32,21.97 21.97,21.97 21.72,22.23 21.72,22.99 22.1,23.37 28.83,23.37 31.11,21.08 45.34,21.08
VR  (via drill 0.3)
  Top 0.203: U5.6 57.33,33.73 v57.15,33.91 | VR1.2 46.2,39.34 45.97,39.12 45.97,38.03 TP21.1 46,37.74 45.14,36.88 v45.14,34.16
  Bottom 0.203: v45.14,34.16 45.52,33.78 52.83,33.78 53.59,33.02 56.39,33.02 57.15,33.78 v57.15,33.91

### Text on the board
tPlace: Programming | RESET | STATUS | GND | RXD | TXD | TP12 | TP28 | TP4 | TP18 | TP20 | TP9 | TP8 | TP15 | TP21 | TP17 | TP16 | TP34 | TP33 | TP10 | TP19 | TP35 | TP36 | RF | TP5 | TP29 | TP27 | TP26 | TP25 | OFF ON | TP30 | TP11 | TP24 | TP37 | TP38 | TP31 | TP22 | TP13 | TP32 | TP3 | TP2 | OFF ON | TP23 | TP6 | Power | TP1 | + | - | BAT | Power IN | PLT Demo Board V2 | TP7
bPlace: UART-RXD | TP20 | VCC IN | TP1 | VR | TP21 | BAT-CHG | TP2 | SWO | TP22 | BAT_CHG | TP3 | SCL | TP23 | BAT-SENSE | TP4 | SDA | TP24 | 5V | TP5 | +24V Input | TP25 | GND | TP6 | Divider 10V | TP26 | GND | TP7 | Divider 5V | TP27 | GND | TP8 | +1V8 Input | TP28 | DCDC | TP9 | AGND1 | TP29 | VDD | TP10 | AGND2 | TP30 | SWDIO | TP11 | AGND3 | TP31 | NRST | TP12 | AGND4 | TP32 | SWDCLK | TP13 | 10uF CAP | TP33 | GND | TP14 | 10uF CAP | TP34 | +5V Input | TP15 | 100nF CAP | TP35 | +3V3 Input | TP16 | 100nF CAP | TP36 | UART-RST | TP17 | 100pF CAP | TP37 | UART-TXD | TP18 | 100pF CAP | TP38 | UART-CTS | TP19
tNames: T10-00499-XX / 20210813 / REV:01
Document: 3:SOLDER MASK / 3.1 LIQUID PHOTO-IMAGED FINISH ON TOP AND BOTTOM SIDES MINIMUM THICKNESS 0.0006" / 3.2 COLOR: / ■ GREEN / □ BLUE / □ BLACK / □ RED / □ White / 4:SILK SCREEN LEGEND / □ BLACK / ■ White / 5:PCB TOLERANCES / 5.1 FINISHED HOLE SIZES SHALL BE +/- 0.003" WITH NO BREAKOUTS / 5.2 SLOT DIMENSIONS SHALL BE +/- 0.005" / 5.3 OVERALL BOARD DIMENSIONS SHALL BE +/- 0.010" / 5.4 HOLE PLATING SHALL BE A MINIMUM OF 0.001" THICK / 5.5 MINIMUM TRACE WIDTH 0.010", MINIMUM TRACE TO TRACE SPACING 0.010" / 5.6 WARP AND TWIST SHALL NOT EXCEED 0.010" PER INCH / 5.7 TOLERANCES ARE NON-ACCUMULATIVE / 6:ELECTRICAL TEST / □ NOT REQUIRED / ■ REQUIRED / 6.1 EACH BOARD MUST BE ELECTRICALLY TESTED FOR CONTINUITY AT THE FARTHEST EXTENT / OF EACH TRACE USING BOTH SIDES IF REQUIRED / 6.2 ADJACENT TRACES MUST HAVE A MINIMUM SURFACE RESISTANCE OF 2.5M OHMS AT 10V / 6.3 Comparative Tracking Index ( CTI ) / □ CTI>600 / □ 400≦CTI<600 / □ 250≦CTI<400 / □ 175≦CTI<250 / ■ 100≦CTI<175 / □ CTI<100) / 7:Stacked and impedance / □ 7.1 See stack-up / □ 7.2 Controlled impedance | NOTES: / 1: MATERIAL / 1.1 PCB MATERIAL SHALL BE / FR-4 (ROHS COMPLIANCE REQUIRED) / SPECIFIC MATERIAL: / □ GF21/A2 / S1130 / ■ S1000 / S1000H / IT-588TC / KB-6160A / KB6160B / KB6160C / □ S1141 / H140A / S1440 / S0440 / NY1140 / □ S1141KF / S0401KF / S1000 / IT-150GTC / IT-158TC / NY2150 / □ S1170 / KB-6168 / S1000-2M / IT-180TC / NY2170 / □ H140H / S6015 Halogen-free / □ H1600 / S1600 / S3116 High CTI / □ AI Base CCL / □ FR-4 + FCCL / □ FCCL / 1.2 Glass Transition Temperature (TG) / ■ ≧135℃ / □ ≧150℃ / □ ≧170℃ / 1.3 PCB Laminate thickness: 0.06299" (+/- 0.006299) / 1.4 THIS PCB IS MULTI-LAYER, NO. OF LAYERS 2 / 1.5 FINISHED COPPER WEIGHT SHALL BE: / ■ ALL LAYERS SHALL BE 1 OZ Finished product copper / □ OUTER LAYERS SHALL BE 1 OZ. Finished product copper / □ INNER LAYERS SHALL BE 2 OZ. / 2: FINISH / 2.1 PCB PLATING: / □ ROHS-Hot air solder leveling(HASL) / □ Immersion tin / □ Immersion silver / ■ Electroless nickel immersion gold (ENIG) / FINISH SHALL MEET REQUIREMENTS OF IPC-4552. / □ Other: / 2.2 PCB MARKING: / 2.21 SUPPLIER TO PLACE DATE CODE (LOT CODE) LOGO AND FLAMMABILITY / RATING IN NON-CONDUCTIVE INK / 2.22 TEXT SIZE MAY VARY BUT MUST REMAIN LEGIBLE / 2.23 TEXT MAY NOT BE PLACED OVER EXPOSED COPPER PADS / 2.3 DATE CODE FORMAT SHALL BE YY/WW / 2.4 USE WHITE EPOXY INK FOR SILKSCREEN / 2.5 Marking on boards / ■ CTI Marking / ■ Yer and Week (YYWW) / ■ Manufacturer logo / ■ UL Marking / ■ 94V-0 / □ ROHS compliancy / ■ Lead-free logo | 1.0 X 4 MARK | 2.0 X 4 NPTH | 备注： / 1.单位：mm / 2.公差：±0.16mm / 3.外形及阴影部份锣出 / 4.未标注的尺寸以GERBER文件为准 / 5.此图为C/S面正视图